# EAGLE design Main-v5.0 (EAGLE 9.1.0)
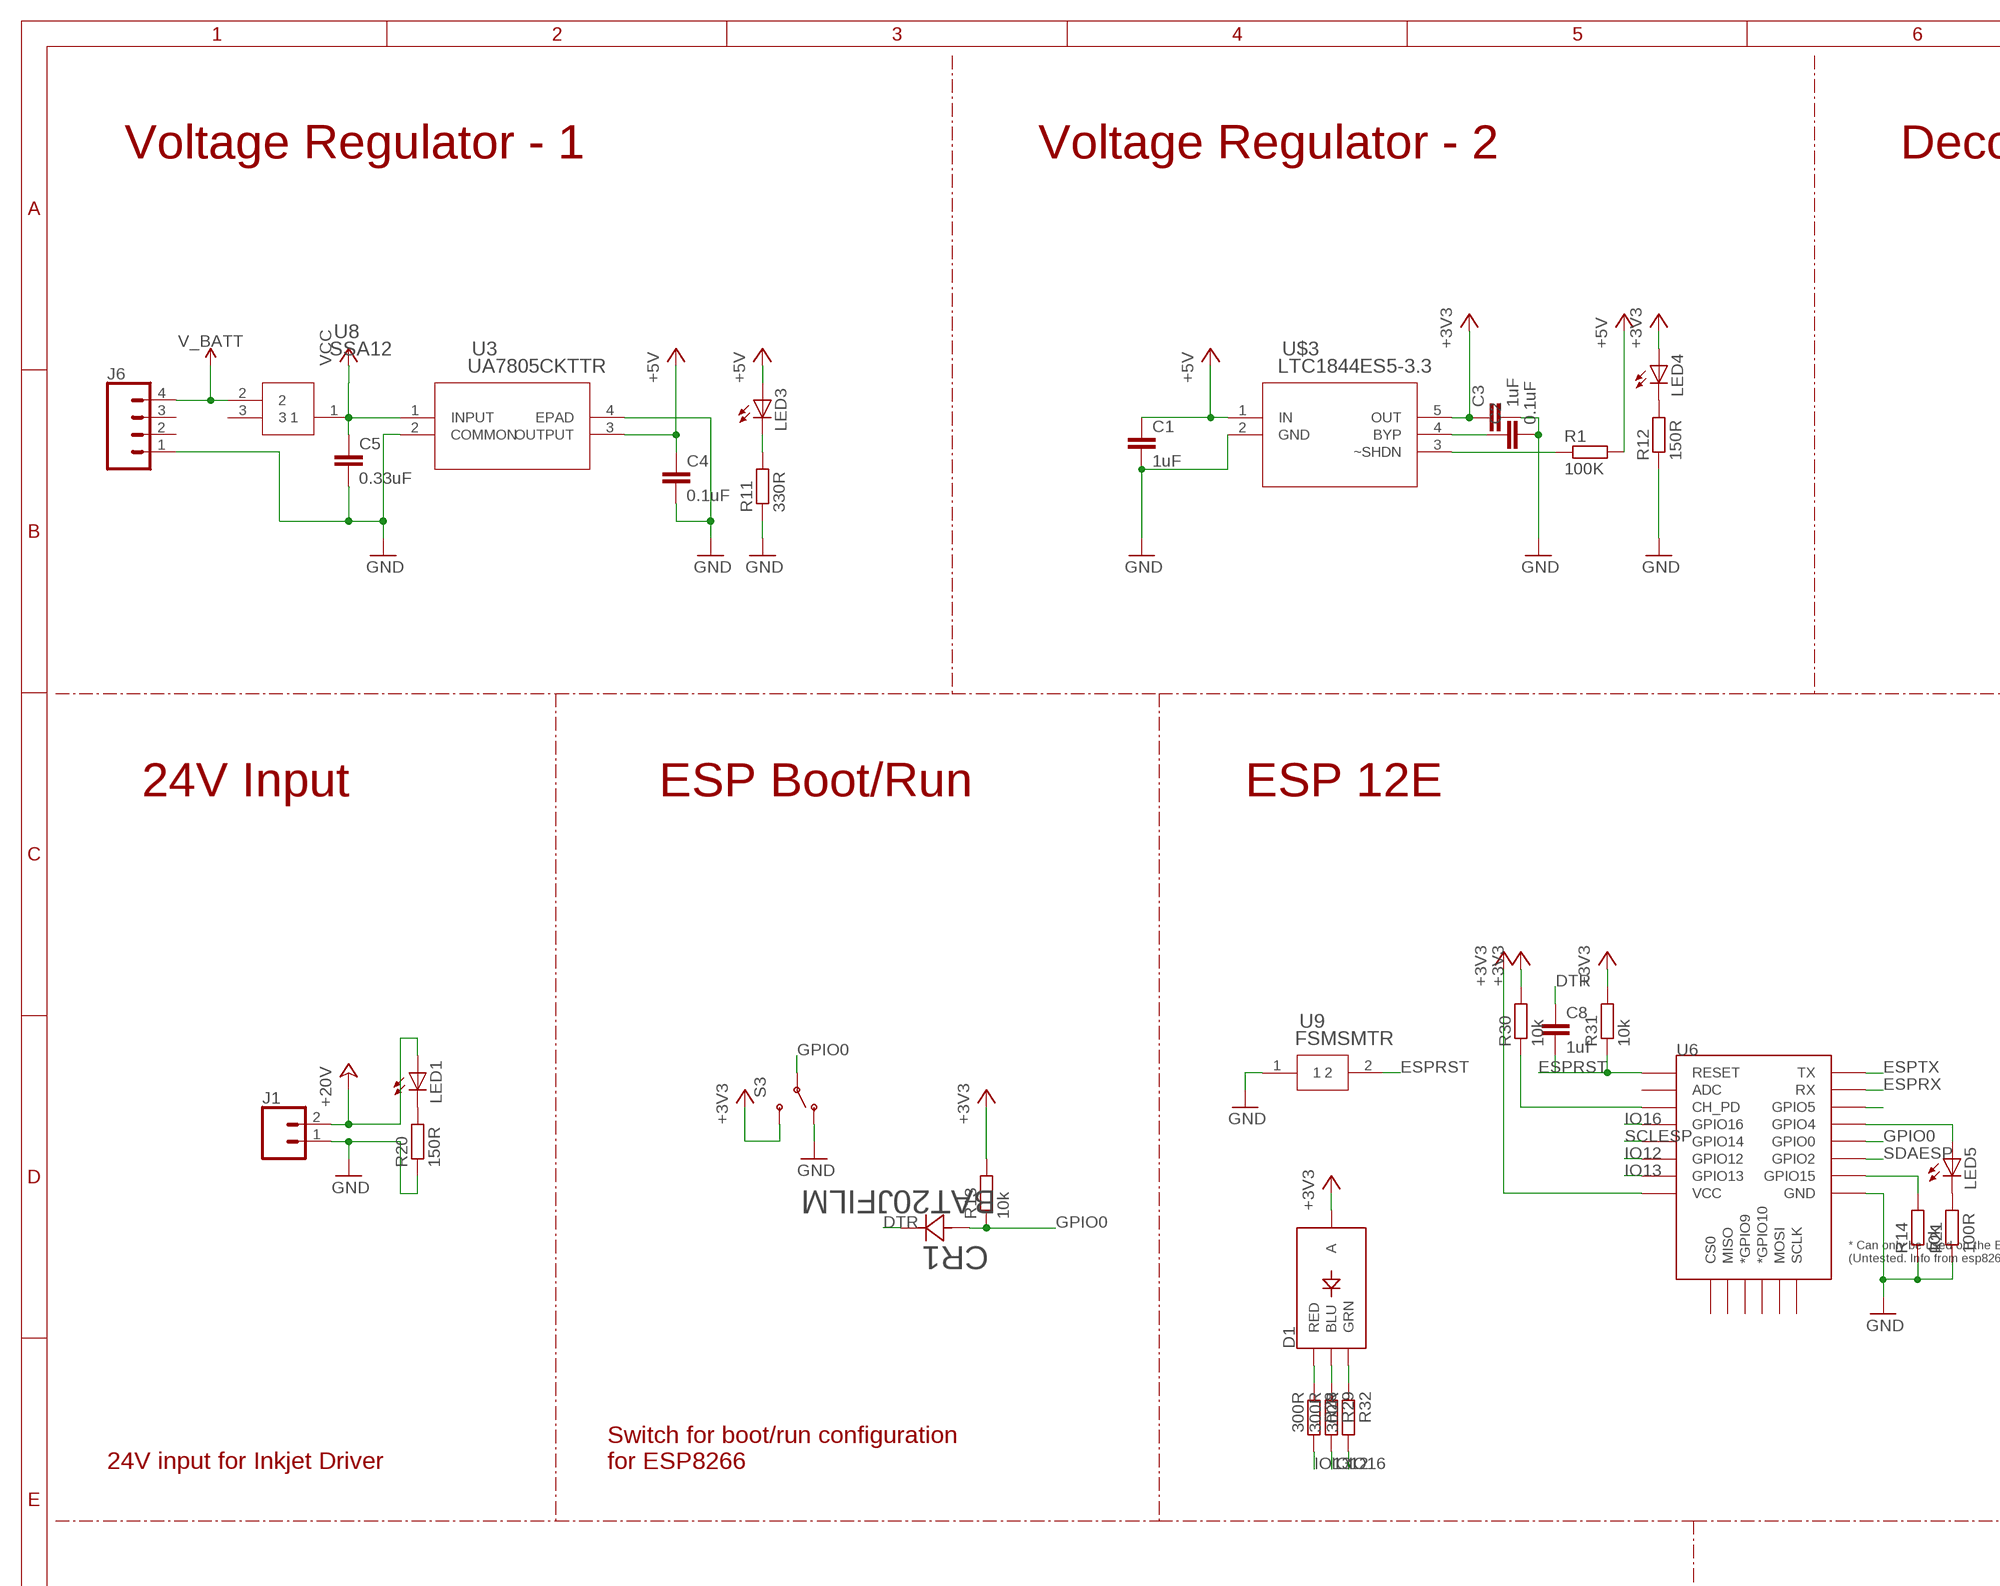
[diagram p0: schematic, sheet 1, part 1 of 3]
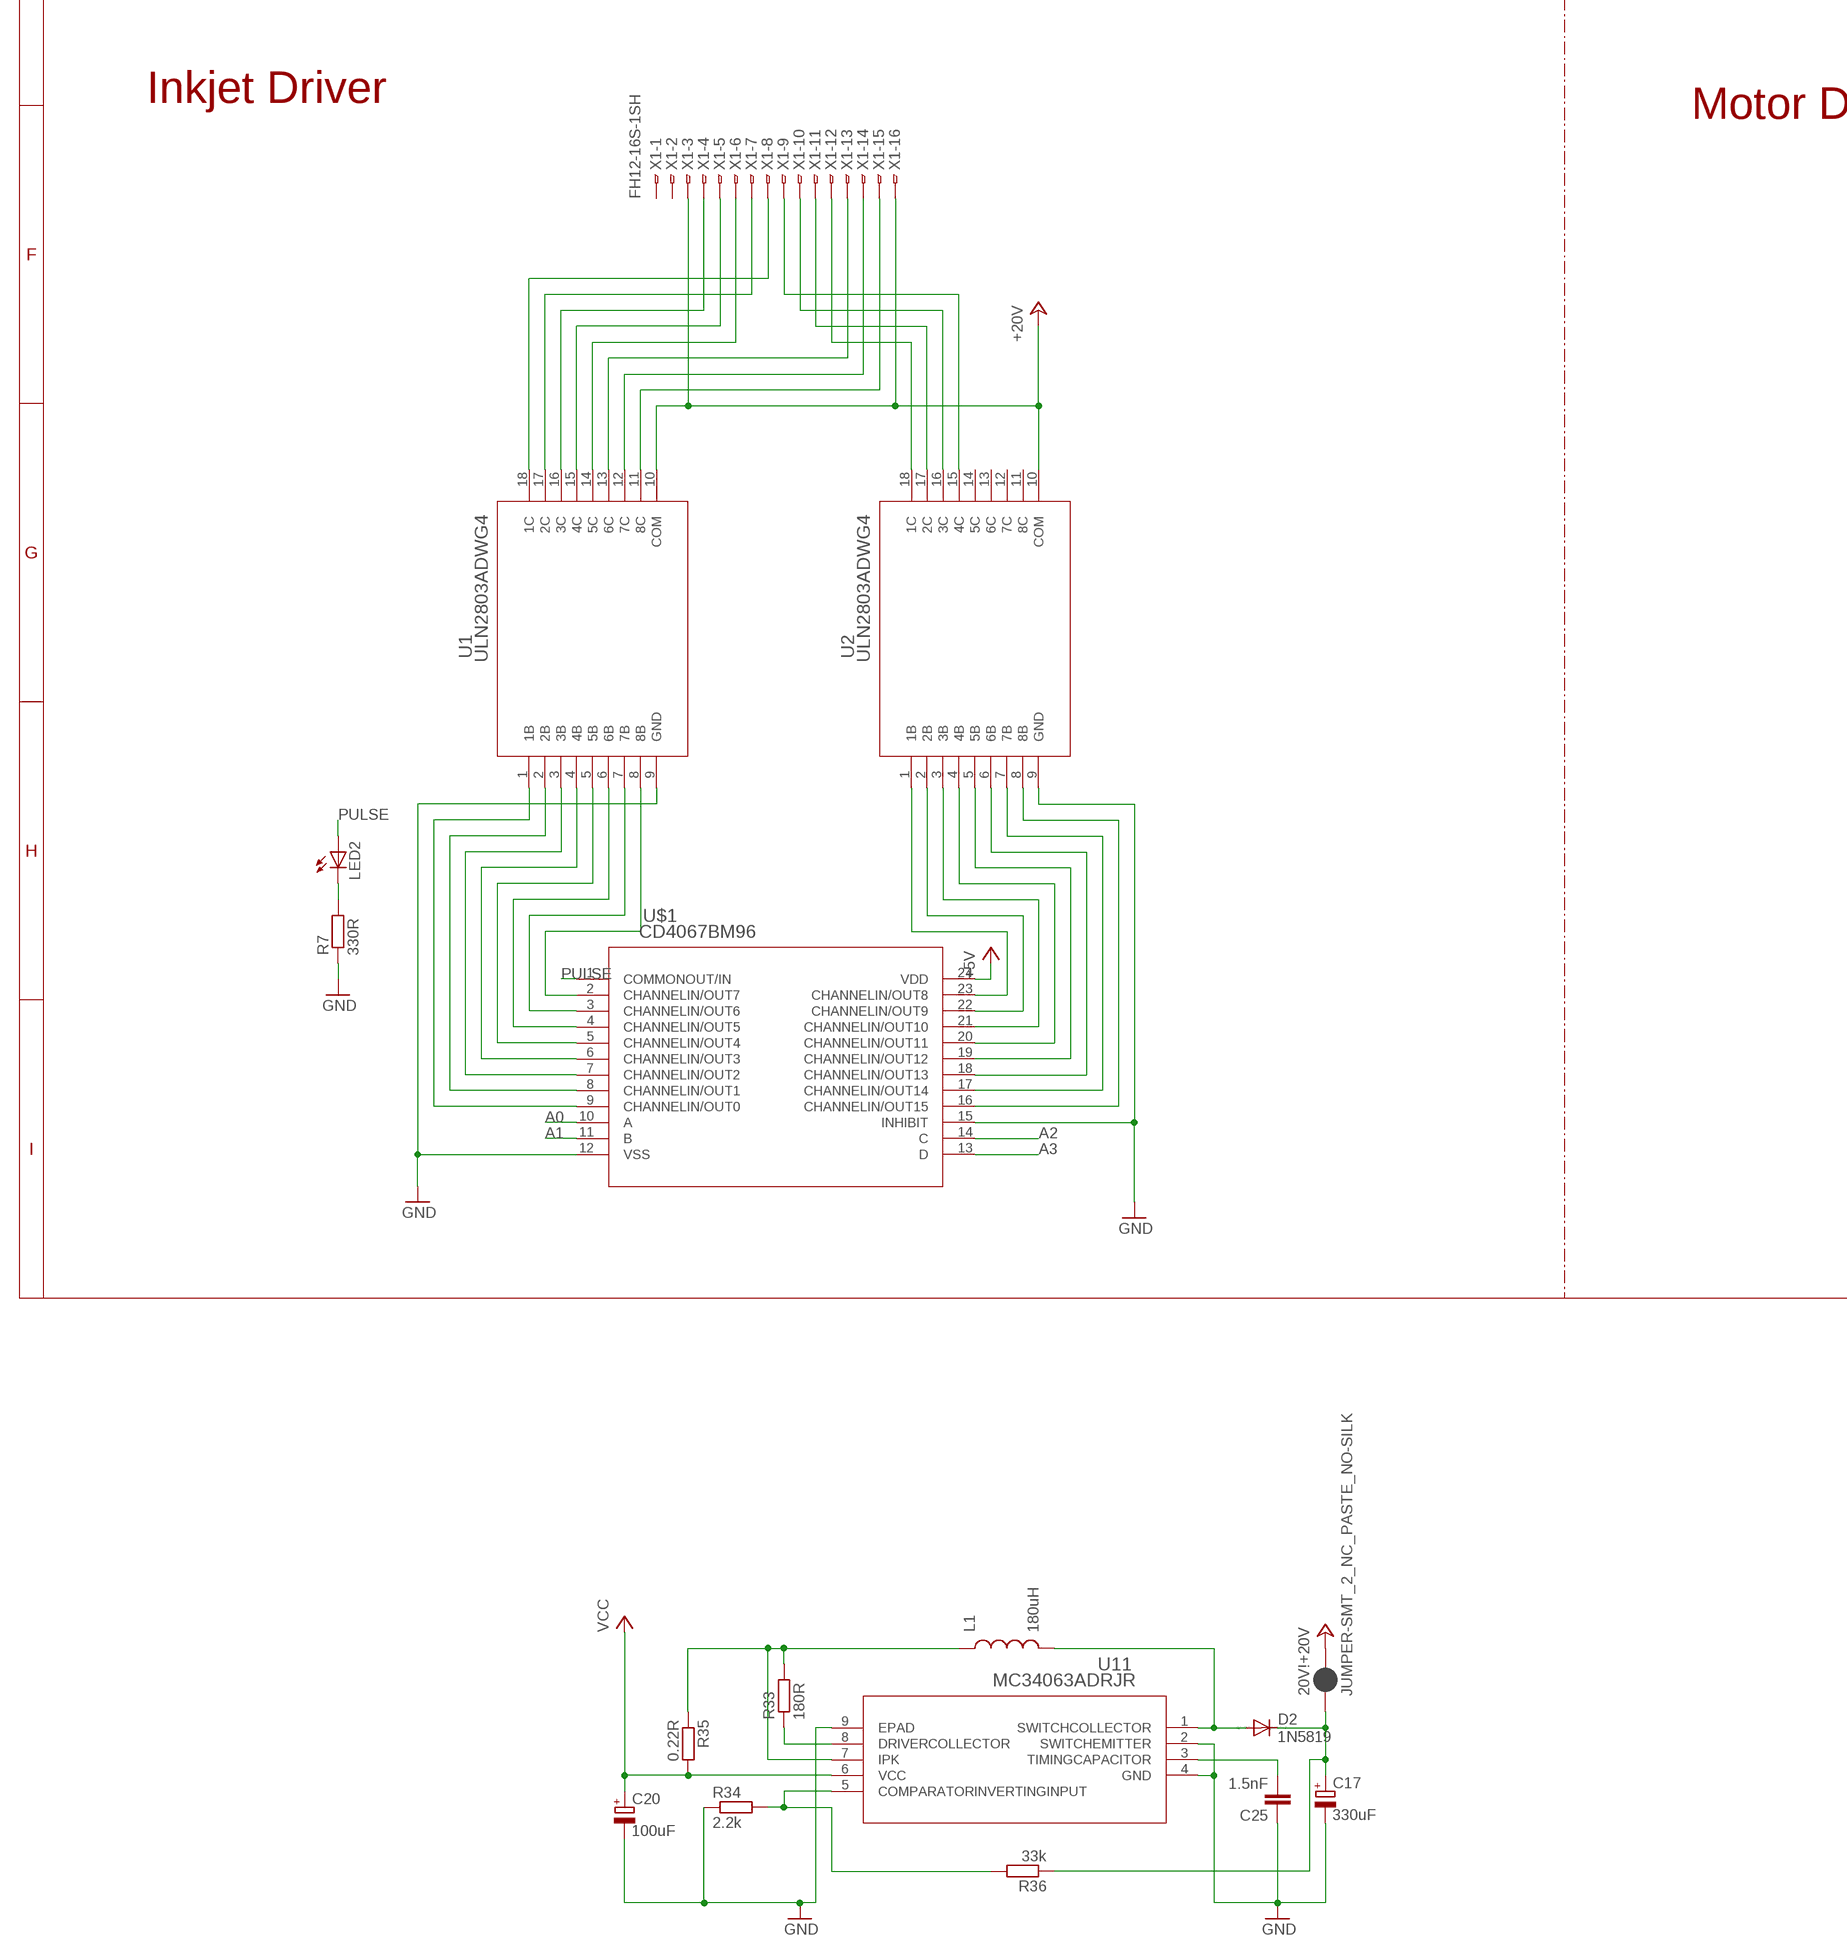
[diagram p1: schematic, sheet 1, part 2 of 3]
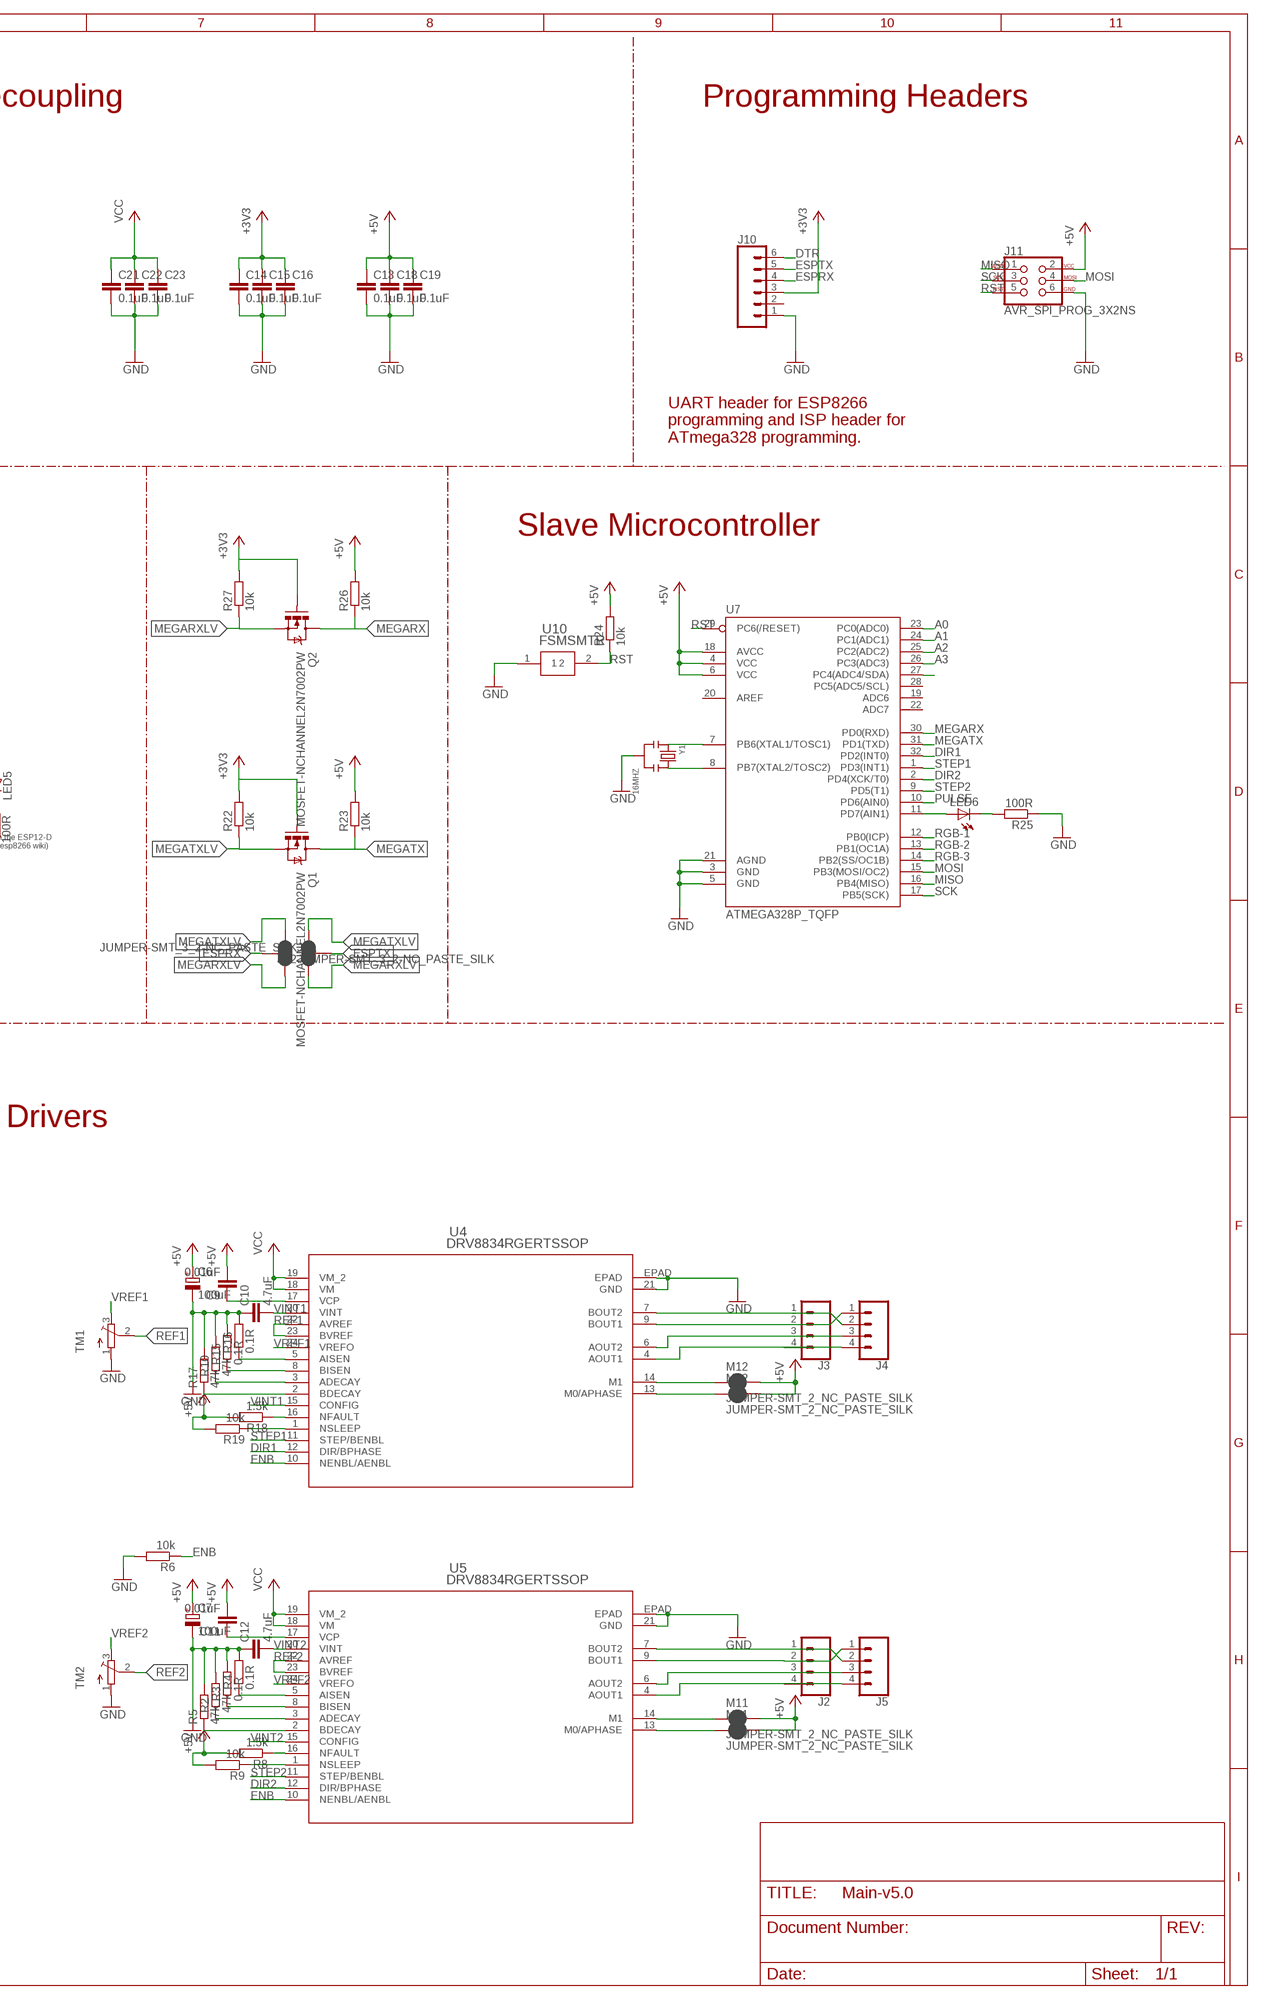
[diagram p2: schematic, sheet 1, part 3 of 3]

## Parts
20V!  JUMPER-SMT_2_NC_PASTE_NO-SILK  [SMT-JUMPER_2_NC_PASTE_NO-SILK]
C1  1uF  C-EUC0603  [C0603]
C2  0.1uF  C-EUC0603  [C0603]
C3  1uF  C-EUC0603  [C0603]
C4  0.1uF  C-EUC0603  [C0603]
C5  0.33uF  C-EUC0603  [C0603]
C6  100uF  CPOL-EUE5-5  [E5-5]
C7  100uF  CPOL-EUE5-5  [E5-5]
C8  1uf  C-EUC0603  [C0603]
C9  0.01uF  C-EUC0603K  [C0603K]
C10  4.7uF  C-EUC0603K  [C0603K]
C11  0.01uF  C-EUC0603K  [C0603K]
C12  4.7uF  C-EUC0603K  [C0603K]
C13  0.1uF  C-EUC0603  [C0603]
C14  0.1uF  C-EUC0603  [C0603]
C15  0.1uF  C-EUC0603  [C0603]
C16  0.1uF  C-EUC0603  [C0603]
C17  330uF  CPOL-EU153CLV-1010  [153CLV-1010]
C18  0.1uF  C-EUC0603  [C0603]
C19  0.1uF  C-EUC0603  [C0603]
C20  100uF  CPOL-EUSMCC  [SMC_C]
C21  0.1uF  C-EUC0603  [C0603]
C22  0.1uF  C-EUC0603  [C0603]
C23  0.1uF  C-EUC0603  [C0603]
C25  1.5nF  C-EUC0603K  [C0603K]
CR1  BAT20JFILM  [SOD-323]
D1  LED-RGB-CASMD  [LED-TRICOLOR-SMD]
D2  1N5819  [SOD123]
J1  CONN_02  [1X02]
J2  CONN_04  [1X04]
J3  CONN_04  [1X04]
J4  CONN_04  [1X04]
J5  CONN_04  [1X04]
J6  CONN_04  [1X04]
J10  CONN_06NO_SILK_NO_POP  [1X06_NO_SILK]
J11  AVR_SPI_PROG_3X2NS  [2X3-NS]
JP1  JUMPER-SMT_3_2-NC_PASTE_SILK  [SMT-JUMPER_3_2-NC_PASTE_SILK]
JP2  JUMPER-SMT_3_2-NC_PASTE_SILK  [SMT-JUMPER_3_2-NC_PASTE_SILK]
L1  180uH  INDUCTORCR54  [CR54]
LED1  LEDSML0603  [SML0603]
LED2  LEDSML0603  [SML0603]
LED3  LEDSML0603  [SML0603]
LED4  LEDSML0603  [SML0603]
LED5  LEDSML0603  [SML0603]
LED6  LEDSML0603  [SML0603]
M01  JUMPER-SMT_2_NC_PASTE_SILK  [SMT-JUMPER_2_NC_PASTE_SILK]
M02  JUMPER-SMT_2_NC_PASTE_SILK  [SMT-JUMPER_2_NC_PASTE_SILK]
M11  JUMPER-SMT_2_NC_PASTE_SILK  [SMT-JUMPER_2_NC_PASTE_SILK]
M12  JUMPER-SMT_2_NC_PASTE_SILK  [SMT-JUMPER_2_NC_PASTE_SILK]
Q1  MOSFET-NCHANNEL2N7002PW  [SOT323]
Q2  MOSFET-NCHANNEL2N7002PW  [SOT323]
R1  100K  R-EU_R0603  [R0603]
R2  47k  R-EU_R0402  [R0402]
R3  0.1R  R-EU_R0402  [R0402]
R4  0.1R  R-EU_R0402  [R0402]
R5  47k  R-EU_R0402  [R0402]
R6  10k  R-EU_R0402  [R0402]
R7  330R  R-EU_R0603  [R0603]
R8  1.5k  R-EU_R0402  [R0402]
R9  10k  R-EU_R0402  [R0402]
R10  47k  R-EU_R0402  [R0402]
R11  330R  R-EU_R0603  [R0603]
R12  150R  R-EU_R0603  [R0603]
R13  10k  R-EU_R0603  [R0603]
R14  10k  R-EU_R0603  [R0603]
R15  0.1R  R-EU_R0402  [R0402]
R16  0.1R  R-EU_R0402  [R0402]
R17  47k  R-EU_R0402  [R0402]
R18  1.5k  R-EU_R0402  [R0402]
R19  10k  R-EU_R0402  [R0402]
R20  150R  R-EU_R0603  [R0603]
R21  100R  R-EU_R0603  [R0603]
R22  10k  R-EU_R0603  [R0603]
R23  10k  R-EU_R0603  [R0603]
R24  10k  R-EU_R0603  [R0603]
R25  100R  R-EU_R0603  [R0603]
R26  10k  R-EU_R0603  [R0603]
R27  10k  R-EU_R0603  [R0603]
R28  300R  R-EU_R0603  [R0603]
R29  300R  R-EU_R0603  [R0603]
R30  10k  R-EU_R0603  [R0603]
R31  10k  R-EU_R0603  [R0603]
R32  300R  R-EU_R0603  [R0603]
R33  180R  R-EU_R0603  [R0603]
R34  2.2k  R-EU_R0603  [R0603]
R35  0.22R  R-EU_R0603  [R0603]
R36  33k  R-EU_R0603  [R0603]
S3  SWITCH-SPDT-SMD-A  [SWITCH-SPST-SMD-A]
TM1  TRIMPOTTC33X  [TC33X]
TM2  TRIMPOTTC33X  [TC33X]
U1  ULN2803ADWG4  [DW18]
U2  ULN2803ADWG4  [DW18]
U3  UA7805CKTTR  [KTT3_6P22X6P6]
U4  DRV8834RGERTSSOP  [PWP_24]
U5  DRV8834RGERTSSOP  [PWP_24]
U6  ESP12ESMD  [ESP12E-SMD]
U7  ATMEGA328P_TQFP  [TQFP32-08]
U8  SSA12  [SWSIP3-P98]
U9  FSMSMTR  [SWITCH_FSMSMTR]
U10  FSMSMTR  [SWITCH_FSMSMTR]
U11  MC34063ADRJR  [DRJ8_2P2X3]
U$1  CD4067BM96  [DW24]
U$3  LTC1844ES5-3.3  [TSOT-23_S5]
X1  FH12-16S-1SH  [FH12-16S-1SH]
Y1  16MHZ  SMD-RESONATOR-16MHZ-15PF-0.5%-40R(3P-3.2X1.3MM)  [X3-SMD-3.6X1.3X0.8MM]

## Nets
+3V3: C3.1 C14.1 C15.1 C16.1 D1.A J10.3 LED4.A Q1.1(G) Q2.1(G) R13.2 R22.2 R27.2 R30.2 R31.2 S3.3(S) U6.VCC U$3.5(OUT)
+5V: C1.1 C4.1 C6.+ C7.+ C9.2 C11.2 C13.1 C18.1 C19.1 J11.2 LED3.A M01.2 M02.2 M11.2 M12.2 R1.2 R8.2 R9.2 R18.2 R19.2 R23.2 R24.2 R26.2 U3.3(OUTPUT) U7.4(VCC) U7.6(VCC) U7.18(AVCC) U$1.24(VDD) U$3.1(IN)
+24V: 20V!.2 J1.2 LED1.A U1.10(COM) U2.10(COM) X1.3 X1.16 ; supply symbol labelled +20V
A0: U7.23(PC0(ADC0)) U$1.10(A)
A1: U7.24(PC1(ADC1)) U$1.11(B)
A2: U7.25(PC2(ADC2)) U$1.14(C)
A3: U7.26(PC3(ADC3)) U$1.13(D)
DIR1: U4.12(DIR/BPHASE) U7.32(PD2(INT0))
DIR2: U5.12(DIR/BPHASE) U7.2(PD4(XCK/T0))
DTR: C8.1 CR1.1 J10.6
ENB: R6.1 U4.10(NENBL/AENBL) U5.10(NENBL/AENBL)
ESPRST: C8.2 R31.1 U6.RESET U9.2
ESPRX: J10.4 JP1.2 U6.RXD0(RX)
ESPTX: J10.5 JP2.2 U6.TXD0(TX)
GND: C1.2 C2.2 C3.2 C4.2 C5.2 C6.- C7.- C10.1 C12.1 C13.2 C14.2 C15.2 C16.2 C17.- C18.2 C19.2 C20.- C21.2 C22.2 C23.2 C25.1 J1.1 J6.1 J10.1 J11.6 R2.2 R3.2 R4.2 R5.2 R6.2 R7.1 R10.2 R11.1 R12.1 R14.1 R15.2 R16.2 R17.2 R20.1 R21.1 R25.1 R34.1 S3.1(O) TM1.1(A) TM2.1(A) U1.9(GND) U2.9(GND) U3.2(COMMON) U3.4(EPAD) U4.21(GND) U4.EPAD U5.21(GND) U5.EPAD U6.GND U7.3(GND) U7.5(GND) U7.21(AGND) U9.1 U10.1 U11.2(SWITCHEMITTER) U11.4(GND) U11.9(EPAD) U$1.12(VSS) U$1.15(INHIBIT) U$3.2(GND) Y1.2
GPIO0: CR1.2 R13.1 S3.2(P) U6.GPIO0
IO12: R29.2 U6.GPIO12
IO13: R28.2 U6.GPIO13
IO16: R32.2 U6.GPIO16
MEGARX: Q2.3(D) R26.1 U7.30(PD0(RXD))
MEGARXLV: JP1.3 JP2.1 Q2.2(S) R27.1
MEGATX: Q1.3(D) R23.1 U7.31(PD1(TXD))
MEGATXLV: JP1.1 JP2.3 Q1.2(S) R22.1
MISO: J11.1 U7.16(PB4(MISO))
MOSI: J11.4 U7.15(PB3(MOSI/OC2))
N$3: U1.8(8B) U$1.2(CHANNELIN/OUT7)
N$4: U1.7(7B) U$1.3(CHANNELIN/OUT6)
N$5: U1.6(6B) U$1.4(CHANNELIN/OUT5)
N$6: U1.5(5B) U$1.5(CHANNELIN/OUT4)
N$7: U1.4(4B) U$1.6(CHANNELIN/OUT3)
N$8: U1.3(3B) U$1.7(CHANNELIN/OUT2)
N$9: U1.2(2B) U$1.8(CHANNELIN/OUT1)
N$10: U1.1(1B) U$1.9(CHANNELIN/OUT0)
N$11: U2.1(1B) U$1.23(CHANNELIN/OUT8)
N$12: U2.2(2B) U$1.22(CHANNELIN/OUT9)
N$13: U2.3(3B) U$1.21(CHANNELIN/OUT10)
N$14: U2.4(4B) U$1.20(CHANNELIN/OUT11)
N$15: U2.5(5B) U$1.19(CHANNELIN/OUT12)
N$16: U2.6(6B) U$1.18(CHANNELIN/OUT13)
N$17: J3.1 J4.2 U4.7(BOUT2)
N$18: J3.2 J4.1 U4.9(BOUT1)
N$19: J3.3 J4.3 U4.6(AOUT2)
N$20: J3.4 J4.4 U4.4(AOUT1)
N$21: U1.11(8C) X1.15
N$22: U1.12(7C) X1.14
N$23: U1.13(6C) X1.13
N$24: U1.14(5C) X1.6
N$25: U1.15(4C) X1.5
N$26: U1.16(3C) X1.4
N$27: U1.17(2C) X1.7
N$28: U1.18(1C) X1.8
N$29: U2.8(8B) U$1.16(CHANNELIN/OUT15)
N$30: U2.18(1C) X1.12
N$31: U2.17(2C) X1.11
N$32: U2.16(3C) X1.10
N$33: U2.15(4C) X1.9
N$34: U2.7(7B) U$1.17(CHANNELIN/OUT14)
N$35: J2.1 J5.2 U5.7(BOUT2)
N$36: J2.2 J5.1 U5.9(BOUT1)
N$37: L1.P$1 R33.2 R35.1 U11.7(IPK)
N$38: C2.1 U$3.4(BYP)
N$39: R1.1 U$3.3(~SHDN)
N$40: J2.3 J5.3 U5.6(AOUT2)
N$41: J2.4 J5.4 U5.4(AOUT1)
N$42: C11.1 U5.17(VCP)
N$43: R5.1 U5.2(BDECAY)
N$44: R2.1 U5.3(ADECAY)
N$45: LED2.C R7.2
N$46: R3.1 U5.8(BISEN)
N$47: R4.1 U5.5(AISEN)
N$48: R9.1 U5.1(NSLEEP)
N$49: R8.1 U5.16(NFAULT)
N$50: LED3.C R11.2
N$51: LED4.C R12.2
N$52: R30.1 U6.CH_PD
N$54: R17.1 U4.2(BDECAY)
N$55: LED6.C R25.2
N$56: LED5.C R21.2
N$57: LED6.A U7.11(PD7(AIN1))
N$58: U7.8(PB7(XTAL2/TOSC2)) Y1.3
N$59: U7.7(PB6(XTAL1/TOSC1)) Y1.1
N$60: D1.R(RED) R28.1
N$61: D1.B(BLU) R29.1
N$62: D1.G(GRN) R32.1
N$65: R10.1 U4.3(ADECAY)
N$66: R15.1 U4.8(BISEN)
N$67: R16.1 U4.5(AISEN)
N$68: C9.1 U4.17(VCP)
N$71: 20V!.1 C17.+ D2.C R36.1
N$72: R34.2 R36.2 U11.5(COMPARATORINVERTINGINPUT)
N$73: R19.1 U4.1(NSLEEP)
N$74: R18.1 U4.16(NFAULT)
N$75: M01.1 U5.13(M0/APHASE)
N$76: M11.1 U5.14(M1)
N$77: M02.1 U4.13(M0/APHASE)
N$78: M12.1 U4.14(M1)
N$79: LED1.C R20.2
N$80: LED5.A U6.GPIO4
N$84: R14.2 U6.GPIO15
N$85: R33.1 U11.8(DRIVERCOLLECTOR)
N$86: D2.A L1.P$2 U11.1(SWITCHCOLLECTOR)
N$88: C25.2 U11.3(TIMINGCAPACITOR)
N$91: U6.GPIO5
PULSE: LED2.A U7.10(PD6(AIN0)) U$1.1(COMMONOUT/IN)
REF1: TM1.2(S) U4.22(AVREF) U4.23(BVREF)
REF2: TM2.2(S) U5.22(AVREF) U5.23(BVREF)
RGB-1: U7.12(PB0(ICP))
RGB-2: U7.13(PB1(OC1A))
RGB-3: U7.14(PB2(SS/OC1B))
RST: J11.5 R24.1 U7.29(PC6(/RESET)) U10.2
SCK: J11.3 U7.17(PB5(SCK))
SCLESP: U6.GPIO14
SDA: U7.27(PC4(ADC4/SDA))
SDAESP: U6.GPIO2
STEP1: U4.11(STEP/BENBL) U7.1(PD3(INT1))
STEP2: U5.11(STEP/BENBL) U7.9(PD5(T1))
V_BATT: J6.4 U8.2
VCC: C5.1 C20.+ C21.1 C22.1 C23.1 R35.2 U3.1(INPUT) U4.18(VM) U4.19(VM_2) U5.18(VM) U5.19(VM_2) U8.1 U11.6(VCC)
VINT1: C10.2 U4.15(CONFIG) U4.20(VINT)
VINT2: C12.2 U5.15(CONFIG) U5.20(VINT)
VREF1: TM1.3(E) U4.24(VREFO)
VREF2: TM2.3(E) U5.24(VREFO)
Unconnected: J6.2 J6.3 J10.2 U2.11(8C) U2.12(7C) U2.13(6C) U2.14(5C) U6.ADC U6.CS0 U6.GPIO9(*GPIO9) U6.GPIO10(*GPIO10) U6.MISO U6.MOSI U6.SCLK U7.19(ADC6) U7.20(AREF) U7.22(ADC7) U7.28(PC5(ADC5/SCL)) U8.3 X1.1 X1.2

## Notes on the sheet
- Voltage Regulator - 1 | Voltage Regulator - 2 | Decoupling | Programming Headers
- UART header for ESP8266
  programming and ISP header for
  ATmega328 programming.
- 24V Input | ESP Boot/Run | ESP 12E | Slave Microcontroller
- 24V input for Inkjet Driver
- Switch for boot/run configuration
  for ESP8266
- Inkjet Driver
- Motor Drivers

## Library data of the parts
20V! M01 M02 M11 M12 = SparkFun-Jumpers:JUMPER-SMT_2_NC_PASTE: Normally closed solder jumper This jumper has an aperture in the stencil to allow solder paste to bridge the split in the wire so it's normally closed (NC). Wick off the solder to open the connection. Reapply solder to reclose the connection.
C1-C5 C8-C16 C18 C19 C21-C23 C25 = resistor:C-EU: CAPACITOR, European symbol
C6 C7 C17 C20 = resistor:CPOL-EU: POLARIZED CAPACITOR, European symbol
CR1 = Beeclust:BAT20JFILM; MANUFACTURER_PART_NUMBER: BAT20JFILM; VENDOR: ST Microelectronics
D1 = SparkFun-LED:LED-RGB-CA: LED-RGB Diffused Common Anode Packages: LED RGB-THRU P-LCC-4-3 LED-TRICOLOR-SMD SparkFun Products: RGB Diffused Common Anode- Diffuse <[https://www.sparkfun.com/products/10821]> RGB Diffused Common Anode - Clear <[https://www.sparkfun.com/products/10820]> Qduino Mini <[https://www.sparkfun.com/products/13614]> Triple Output LED RGB - SMD <https://www.sparkfun.com/products/7844>; PROD_ID: DIO-08324
D2 = Beeclust:1N5819: SCHOTTKY BARRIER RECTIFIER Source: http://onsemi.com .. MBR0520LT1-D.pdf
J1 = SparkFun-Connectors:CONN_02: Multi connection point. Often used as Generic Header-pin footprint for 0.1 inch spaced/style header connections On any of the 0.1 inch spaced packages, you can populate with these: Break Away Headers - Straight <https://www.sparkfun.com/products/116> (PRT-00116) Break Away Male Headers - Right Angle <https://www.sparkfun.com/products/553> (PRT-00553) Female Headers <https://www.sparkfun.com/products/115> (PRT-00115) Break Away Headers - Machine Pin <https://www.sparkfun.com/products/117> (PRT-00117) Break Away Female Headers - Swiss Machine Pin <https://www.sparkfun.com/products/743> (PRT-00743) For SCREWTERMINALS and SPRING TERMINALS visit here: Screw Terimnals on SparkFun.com <https://www.sparkfun.com/search/results?term=Screw+Terminals> (5mm/3.5mm/2.54mm spacing) This device is also useful as a general connection point to wire up your design to another part of your project. Our various solder wires solder well into these plated through hole pads. Hook-Up Wire - Assortment (Stranded, 22 AWG) <https://www.sparkfun.com/products/11375> (PRT-11375) Hook-Up Wire - Assortment (Solid Core, 22 AWG) <https://www.sparkfun.com/products/11367> (PRT-11367) View the entire wire category on our website here <https://www.sparkfun.com/categories/141> Special notes: Molex polarized connector foot print use with: PRT-08233 with associated crimp pins and housings. 2.54_SCREWTERM for use with PRT-10571. 3.5mm Screw Terminal footprints for PRT-08084 5mm Screw Terminal footprints for use with PRT-08432
J2-J6 = SparkFun-Connectors:CONN_04: Multi connection point. Often used as Generic Header-pin footprint for 0.1 inch spaced/style header connections On any of the 0.1 inch spaced packages, you can populate with these: Break Away Headers - Straight <https://www.sparkfun.com/products/116> (PRT-00116) Break Away Male Headers - Right Angle <https://www.sparkfun.com/products/553> (PRT-00553) Female Headers <https://www.sparkfun.com/products/115> (PRT-00115) Break Away Headers - Machine Pin <https://www.sparkfun.com/products/117> (PRT-00117) Break Away Female Headers - Swiss Machine Pin <https://www.sparkfun.com/products/743> (PRT-00743) For SCREWTERMINALS and SPRING TERMINALS visit here: Screw Terimnals on SparkFun.com <https://www.sparkfun.com/search/results?term=Screw+Terminals> (5mm/3.5mm/2.54mm spacing) This device is also useful as a general connection point to wire up your design to another part of your project. Our various solder wires solder well into these plated through hole pads. Hook-Up Wire - Assortment (Stranded, 22 AWG) <https://www.sparkfun.com/products/11375> (PRT-11375) Hook-Up Wire - Assortment (Solid Core, 22 AWG) <https://www.sparkfun.com/products/11367> (PRT-11367) View the entire wire category on our website here <https://www.sparkfun.com/categories/141> Special notes: Molex polarized connector foot print use with SKU : PRT-08231 with associated crimp pins and housings. 1MM SMD Version SKU: PRT-10208; PROD_ID: CONN-09696
J10 = SparkFun-Connectors:CONN_06: Multi connection point. Often used as Generic Header-pin footprint for 0.1 inch spaced/style header connections On any of the 0.1 inch spaced packages, you can populate with these: Break Away Headers - Straight <https://www.sparkfun.com/products/116> (PRT-00116) Break Away Male Headers - Right Angle <https://www.sparkfun.com/products/553> (PRT-00553) Female Headers <https://www.sparkfun.com/products/115> (PRT-00115) Break Away Headers - Machine Pin <https://www.sparkfun.com/products/117> (PRT-00117) Break Away Female Headers - Swiss Machine Pin <https://www.sparkfun.com/products/743> (PRT-00743) Arduino Stackable Header - 6 Pin <https://www.sparkfun.com/products/9280> (PRT-09280) For SCREWTERMINALS and SPRING TERMINALS visit here: Screw Terimnals on SparkFun.com <https://www.sparkfun.com/search/results?term=Screw+Terminals> (5mm/3.5mm/2.54mm spacing) This device is also useful as a general connection point to wire up your design to another part of your project. Our various solder wires solder well into these plated through hole pads. Hook-Up Wire - Assortment (Stranded, 22 AWG) <https://www.sparkfun.com/products/11375> (PRT-11375) Hook-Up Wire - Assortment (Solid Core, 22 AWG) <https://www.sparkfun.com/products/11367> (PRT-11367) View the entire wire category on our website here <https://www.sparkfun.com/categories/141>
J11 = SparkFun-Connectors:AVR_SPI_PROG_3X2: AVR ISP 6 Pin This is the reduced ISP connector for AVR programming. Common on Arduino. This footprint will take up less PCB space and can be used with a 10-pin to 6-pin adapter such as SKU: BOB-08508 **Special note about "TEST_POINT" package. The stop mask is on the top side, so if you want your programming test points to be on the bottom of your board, make sure to place this package on the bottom side of the board. This also ensure that the orientation to program from the bottom side will be correct. SparkFun Products: SparkFun ISP Pogo Adapter <https://www.sparkfun.com/products/11591> - NS Tiny AVR Programmer <https://www.sparkfun.com/products/11801> -PTH
JP1 JP2 = SparkFun-Jumpers:JUMPER-SMT_3_2-NC_PASTE: Normally closed solder jumper (2 of 2 connections) This jumper has an aperture in the stencil to allow solder paste to bridge both connections. Both connections are normally closed (NC). Wick off the solder to open the connection(s). Reapply solder to reclose the connection(s).
L1 = adjacent-reality:INDUCTOR: Inductors Basic Inductor/Choke - 0603 and 1206. Footprints are not proven and vary greatly between part numbers. CC-BY-SA from SparkFun
LED1-LED6 = led:LED: LED OSRAM: - CHIPLED LG R971, LG N971, LY N971, LG Q971, LY Q971, LO R971, LY R971 LH N974, LH R974 LS Q976, LO Q976, LY Q976 LO Q996 - Hyper CHIPLED LW Q18S LB Q993, LB Q99A, LB R99A - SideLED LS A670, LO A670, LY A670, LG A670, LP A670 LB A673, LV A673, LT A673, LW A673 LH A674 LY A675 LS A676, LA A676, LO A676, LY A676, LW A676 LS A679, LY A679, LG A679 - Hyper Micro SIDELED® LS Y876, LA Y876, LO Y876, LY Y876 LT Y87S - SmartLED LW L88C, LW L88S LB L89C, LB L89S, LG L890 LS L89K, LO L89K, LY L89K LS L896, LA L896, LO L896, LY L896 - TOPLED LS T670, LO T670, LY T670, LG T670, LP T670 LSG T670, LSP T670, LSY T670, LOP T670, LYG T670 LG T671, LOG T671, LSG T671 LB T673, LV T673, LT T673, LW T673 LH T674 LS T676, LA T676, LO T676, LY T676, LB T676, LH T676, LSB T676, LW T676 LB T67C, LV T67C, LT T67C, LS T67K, LO T67K, LY T67K, LW E67C LS E67B, LA E67B, LO E67B, LY E67B, LB E67C, LV E67C, LT E67C LW T67C LS T679, LY T679, LG T679 LS T770, LO T770, LY T770, LG T770, LP T770 LB T773, LV T773, LT T773, LW T773 LH T774 LS E675, LA E675, LY E675, LS T675 LS T776, LA T776, LO T776, LY T776, LB T776 LHGB T686 LT T68C, LB T68C - Hyper Mini TOPLED® LB M676 - Mini TOPLED Santana® LG M470 LS M47K, LO M47K, LY M47K Source: http://www.osram.convergy.de LUXEON: - LUMILED® LXK2-PW12-R00, LXK2-PW12-S00, LXK2-PW14-U00, LXK2-PW14-V00 LXK2-PM12-R00, LXK2-PM12-S00, LXK2-PM14-U00 LXK2-PE12-Q00, LXK2-PE12-R00, LXK2-PE12-S00, LXK2-PE14-T00, LXK2-PE14-U00 LXK2-PB12-K00, LXK2-PB12-L00, LXK2-PB12-M00, LXK2-PB14-N00, LXK2-PB14-P00, LXK2-PB14-Q00 LXK2-PR12-L00, LXK2-PR12-M00, LXK2-PR14-Q00, LXK2-PR14-R00 LXK2-PD12-Q00, LXK2-PD12-R00, LXK2-PD12-S00 LXK2-PH12-R00, LXK2-PH12-S00 LXK2-PL12-P00, LXK2-PL12-Q00, LXK2-PL12-R00 Source: www.luxeon.com KINGBRIGHT: KA-3528ASYC Source: www.kingbright.com
Q1 Q2 = SparkFun-DiscreteSemi:MOSFET-NCHANNEL: Common NMOSFET Parts MFG P/N Store ID Prod ID FDD8780 TRANS-09984 SI7820DN TRANS-11055 FDS6630A IC-08089 2N7002PW TRANS-11151 FQP30N06L COM-10213 TRANS-10060 BSS123LT1G TRANS-08345 BSS138 TRANS-00830 BS170 2N7000; PROD_ID: TRANS-11151
R1-R36 = resistor:R-EU_: RESISTOR, European symbol
S3 = SparkFun-Electromechanical:SWITCH-SPDT: SPDT Switch Simple slide switch, Spark Fun Electronics SKU : COM-00102 DPDT SMT slide switch, AYZ0202, SWCH-08179; PROD_ID: SWCH-10651
TM1 TM2 = adafruit:TRIMPOT: SMT trimmer potentiometer part number TC33X http://www.ladyada.net/library/eagle
U1 U2 = Beeclust:ULN2803ADWG4; MANUFACTURER_PART_NUMBER: ULN2803ADWG4; VENDOR: Texas Instruments
U3 = Beeclust:UA7805CKTTR; MANUFACTURER_PART_NUMBER: UA7805CKTTR; VENDOR: Texas Instruments
U4 U5 = Beeclust:DRV8834RGER
U6 = esp8266modules:ESP12E: ESP12E Module
U7 = SparkFun-IC-Microcontroller:ATMEGA328P_TQFP: Popular 328P in QFP Storefront component: ATmega328 - TQFP <https://www.sparkfun.com/products/13448> (COM-13448) Datasheet <http://www.sparkfun.com/datasheets/Components/SMD/ATMega328.pdf> SparkFun Products SparkFun RedBoard - Programmed with Arduino <https://www.sparkfun.com/products/12757> (DEV-12757) Arduino Pro Mini 328 - 5V/16MHz <https://www.sparkfun.com/products/11113> (DEV-11113) Arduino Pro Mini 328 - 3.3V/8MHz <https://www.sparkfun.com/products/11114> (DEV-11114) SparkFun OpenLog <https://www.sparkfun.com/products/13712> (DEV-13712) SparkFun MicroView - OLED Arduino Module <https://www.sparkfun.com/products/12923> (DEV-12923) SparkFun Digital Sandbox <https://www.sparkfun.com/products/12651> (DEV-12651) SparkFun PicoBoard <https://www.sparkfun.com/products/11888> (WIG-11888) Arduino Fio <https://www.sparkfun.com/products/10116> (DEV-10116) LilyPad Arduino 328 Main Board <https://www.sparkfun.com/products/13342> (DEV-13342) SparkFun RedStick <https://www.sparkfun.com/products/13741> (DEV-13741) LilyPad MP3 <https://www.sparkfun.com/products/11013> (DEV-11013) LilyPad Arduino SimpleSnap <https://www.sparkfun.com/products/10941> (DEV-10941) SparkFun Stepoko <https://www.sparkfun.com/products/13899> (ROB-13899) SparkFun Geiger Counter <https://www.sparkfun.com/products/11345> (SEN-11345) SparkFun EL Sequencer <https://www.sparkfun.com/products/12781> (COM-12781) Arduino Pro 328 - 5V/16MHz <https://www.sparkfun.com/products/10915> (DEV-10915) CryptoCape <https://www.sparkfun.com/products/12773> (DEV-12773) SparkFun IR Thermometer Evaluation Board - MLX90614 <https://www.sparkfun.com/products/10740> (SEN-10740) SparkFun RedBot Mainboard <https://www.sparkfun.com/products/12097> (ROB-12097) Arduino Pro 328 - 3.3V/8MHz <https://www.sparkfun.com/products/10914> (DEV-10914) SparkFun Block for Intel® Edison - Arduino <https://www.sparkfun.com/products/13036> (DEV-13036) SparkFun Simon Says - Surface Mount Soldering Kit <https://www.sparkfun.com/products/10935> (KIT-10935) SparkFun 7-Segment Serial Display - Red <https://www.sparkfun.com/products/11441> (COM-11441) SparkFun 7-Segment Serial Display - White <https://www.sparkfun.com/products/11629> (COM-11629) SparkFun 7-Segment Serial Display - Yellow <https://www.sparkfun.com/products/11443> (COM-11443) SparkFun 7-Segment Serial Display - Kelly Green <https://www.sparkfun.com/products/11440> (COM-11440) SparkFun 7-Segment Serial Display - Blue <https://www.sparkfun.com/products/11442> (COM-11442) SparkFun OpenSegment Serial Display - 20mm (Blue) <https://www.sparkfun.com/products/11647> (COM-11647) SparkFun OpenSegment Serial Display - 20mm (Green) <https://www.sparkfun.com/products/11646> (COM-11646) SparkFun OpenSegment Serial Display - 20mm (White) <https://www.sparkfun.com/products/11648> (COM-11648) SparkFun OpenSegment Serial Display - 20mm (Red) <https://www.sparkfun.com/products/11644> (COM-11644) SparkFun OpenSegment Serial Display - 20mm (Yellow) <https://www.sparkfun.com/products/11645> (COM-11645) SparkFun OpenSegment Shield <https://www.sparkfun.com/products/13190> (DEV-13190); PROD_ID: IC-09069
U8 = Beeclust:SSA12; MANUFACTURER_PART_NUMBER: SSA12; VENDOR: TE Connectivity
U9 U10 = Beeclust:FSMSMTR; MANUFACTURER_PART_NUMBER: FSMSMTR; VENDOR: TE Connectivity
U11 = Beeclust:MC34063ADRJR; MANUFACTURER_PART_NUMBER: MC34063ADRJR; VENDOR: Vendor
U$1 = Beeclust:CD4067BM96; MANUFACTURER_PART_NUMBER: CD4067B_DW_24; VENDOR: Texas Instruments
U$3 = Beeclust:LTC1844ES5-3.3
X1 = con-hirose:FH12-16S-1S: 1mm Pitch Connectors For FPC/FFC Source: Data sheet <http://www.hirose.co.jp/cataloge_hp/e58605370.pdf>; OC_FARNELL: unknown; OC_NEWARK: unknown
Y1 = Seeed-Crystal Oscillator:SMD-RESONATOR-16MHZ-15PF-0.5%-40R(3P-3.2X1.3MM): 306030002; MPN: CSTCE16M0V53-R0

## Board
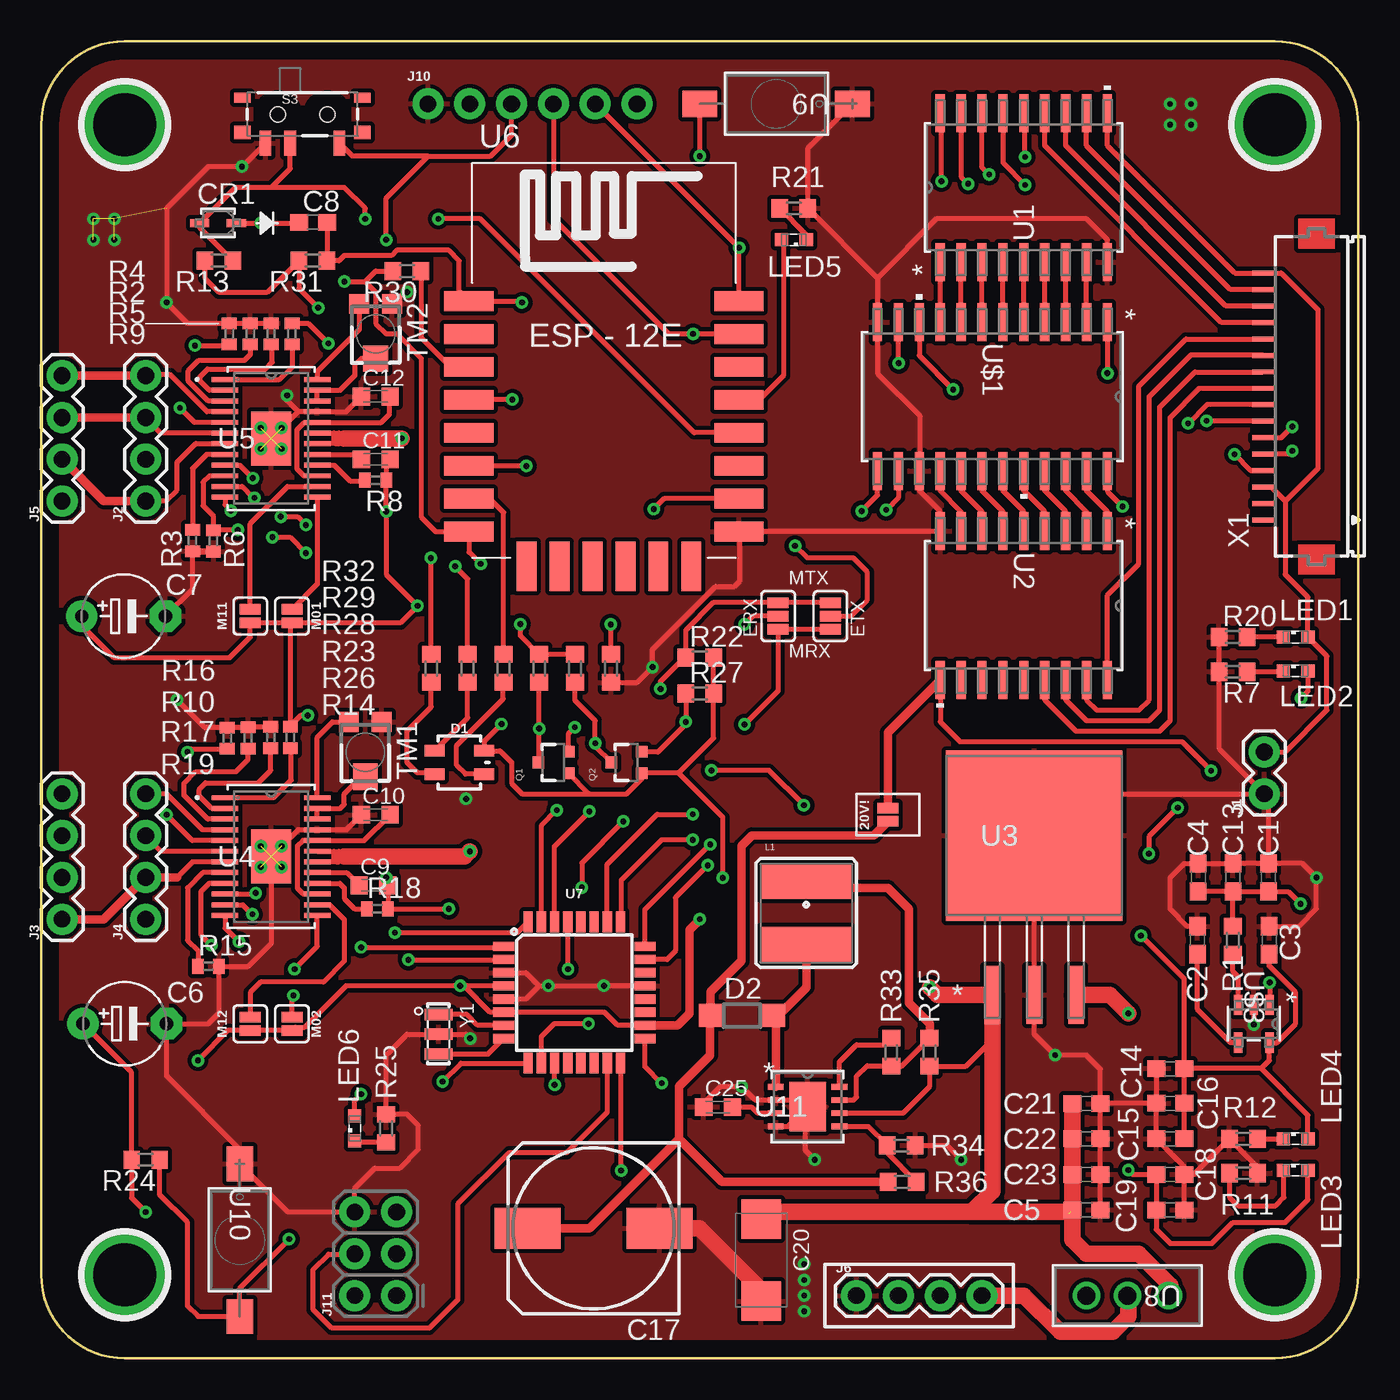
[diagram p3: board, top side]
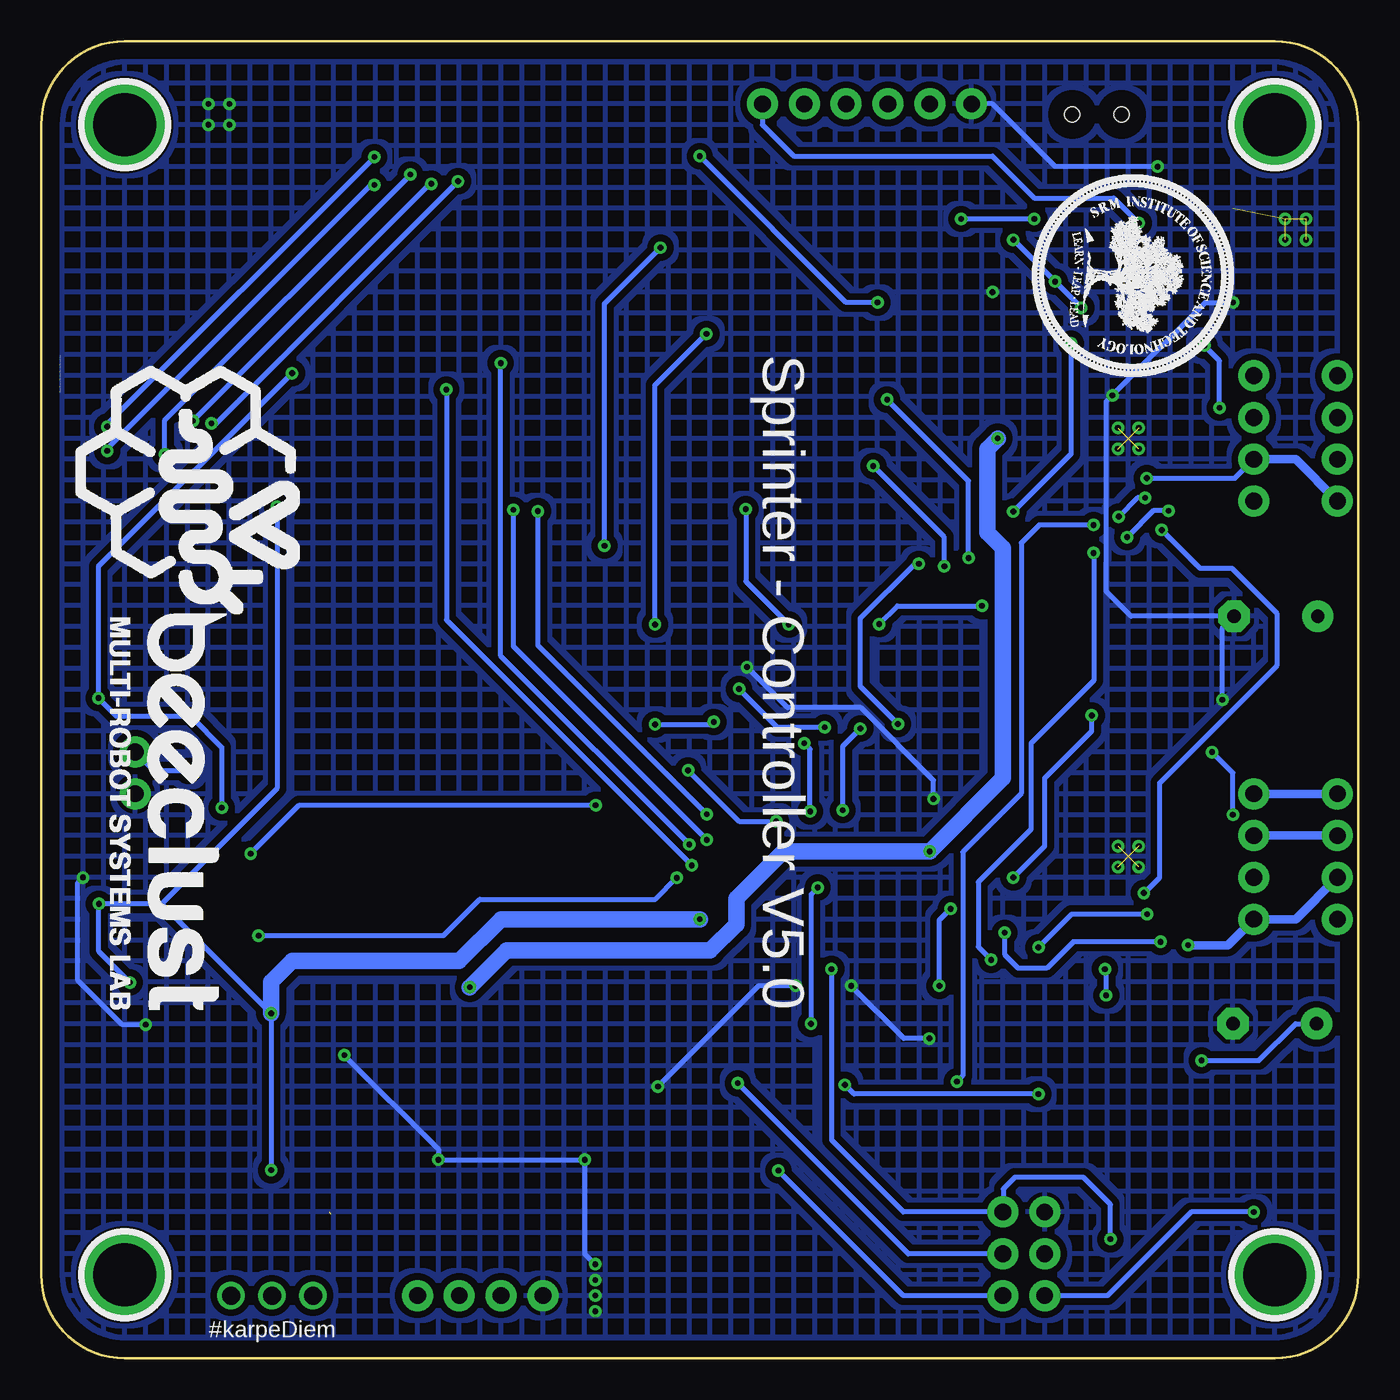
[diagram p4: board, bottom side, seen from below]

Size 80.01 x 80.01 mm. Coordinates in mm from the lower left corner, seen from the top.
Outline: 80.01,5.08 80.01,72.39
Outline: 80.01,5.08 80.01,74.93 arc90 74.93,80.01 5.08,80.01 arc90 0,74.93 0,5.08 arc90 5.08,0 74.93,0 arc90 80.01,5.08
Copper layers (1*16): Top 0.035mm / dielectric 1.5mm / Bottom 0.035mm
Design rules "default *": minimum track width 6mil, minimum drill 0.35mm, track to track 6mil, track to pad 6mil, pad to pad 6mil, via to via 6mil, smd to smd 6mil, copper to edge 40mil, drill to drill 6mil, minimum pad ring 10mil, minimum via ring 8mil, stop-mask expansion 4mil, vias tented up to drill 14mil, thermal gap 10mil

### Footprints (pad centres in the part's own frame; a part is rotated, then mirrored left to right if it is on the bottom)
SMT-JUMPER_2_NC_PASTE_NO-SILK = smd 0.635 x 1.27: 1 -0.406,0; 2 0.406,0
C0603 = smd 1.1 x 1: 1 -0.85,0; 2 0.85,0
E5-5 = drill 0.813 pad 1.905: + -2.54,0 | drill 0.813 pad 1.905 octagon: - 2.54,0
C0603K = smd 1.05 x 1.08: 1 -0.875,0; 2 0.875,0
153CLV-1010 = smd 4 x 2.5: + 4,0; - -4,0
SMC_C = smd 2.4 x 2.4: + -2.5,0; - 2.5,0
SOD-323 = smd 1.168 x 0.483: 1 -1.118,0; 2 1.118,0
LED-TRICOLOR-SMD = smd 1.2 x 0.7: A 1.5,0.7; B -1.5,0.7; G -1.5,-0.7; R 1.5,-0.7
SOD123 = smd 1.4 x 1.4: A 1.9,0; C -1.9,0
1X02 = drill 1.016 pad 1.88: 1 0,0; 2 2.54,0
1X04 = drill 1.016 pad 1.88: 1 0,0; 2 2.54,0; 3 5.08,0; 4 7.62,0
1X06_NO_SILK = drill 1.016 pad 1.88: 1 0,0; 2 2.54,0; 3 5.08,0; 4 7.62,0; 5 10.16,0; 6 12.7,0
2X3-NS = drill 1.016 pad 1.88: 1 -2.54,-1.27; 2 -2.54,1.27; 3 0,-1.27; 4 0,1.27; 5 2.54,-1.27; 6 2.54,1.27
SMT-JUMPER_3_2-NC_PASTE_SILK = smd 0.635 x 1.27: 1 -0.813,0; 2 0,0; 3 0.813,0
CR54 = smd 5.5 x 2.15: P$1 0,1.92; P$2 0,-1.92
SML0603 = smd 0.8 x 0.8: A 0.75,0; C -0.75,0
SMT-JUMPER_2_NC_PASTE_SILK = smd 0.635 x 1.27: 1 -0.406,0; 2 0.406,0
SOT323 = smd 0.7 x 0.7: 1 -0.65,-0.925; 2 0.65,-0.925; 3 0,0.925
R0603 = smd 1 x 1.1: 1 -0.85,0; 2 0.85,0
R0402 = smd 0.7 x 0.9: 1 -0.65,0; 2 0.65,0
SWITCH-SPST-SMD-A = smd 0.7 x 1.5: 1 -2.25,-1.75; 2 -0.75,-1.75; 3 2.25,-1.75 | smd 1 x 0.6: GND1 -3.65,1; GND3 3.65,1 | smd 1 x 0.8: GND2 -3.65,-1.1; GND4 3.65,-1.1 | hole 0.9: -1.5,0; 1.5,0
TC33X = smd 1.2 x 1.2: 1 -1,-1.825; 3 1,-1.825 | smd 1.5 x 1.6: 2 0,1.5
DW18 = smd 2.311 x 0.559: 1 -4.521,5.08; 2 -4.521,3.81; 3 -4.521,2.54; 4 -4.521,1.27; 5 -4.521,0; 6 -4.521,-1.27; 7 -4.521,-2.54; 8 -4.521,-3.81; 9 -4.521,-5.08; 10 4.521,-5.08; 11 4.521,-3.81; 12 4.521,-2.54; 13 4.521,-1.27; 14 4.521,0; 15 4.521,1.27; 16 4.521,2.54; 17 4.521,3.81; 18 4.521,5.08
KTT3_6P22X6P6 = smd 0.965 x 3.505: 1 -2.54,-9.677; 2 0,-9.677; 3 2.54,-9.677 | smd 10.719 x 10.363: 4 0,0
PWP_24 = smd 1.6 x 0.3: 1 -2.8,3.575; 2 -2.8,2.925; 3 -2.8,2.275; 4 -2.8,1.625; 5 -2.8,0.975; 6 -2.8,0.325; 7 -2.8,-0.325; 8 -2.8,-0.975; 9 -2.8,-1.625; 10 -2.8,-2.275; 11 -2.8,-2.925; 12 -2.8,-3.575; 13 2.8,-3.575; 14 2.8,-2.925; 15 2.8,-2.275; 16 2.8,-1.625; 17 2.8,-0.975; 18 2.8,-0.325; 19 2.8,0.325; 20 2.8,0.975; 21 2.8,1.625; 22 2.8,2.275; 23 2.8,2.925; 24 2.8,3.575 | smd 2.4 x 3.28: EPAD 0,0
ESP12E-SMD = smd 3 x 1.2: ADC -8.3,3.8; CH_PD -8.3,1.8; GND 8.1,-8.2; GPIO0 8.1,-2.2; GPIO2 8.1,-4.2; GPIO4 8.1,-0.2; GPIO5 8.1,1.8; GPIO12 -8.3,-4.2; GPIO13 -8.3,-6.2; GPIO14 -8.3,-2.2; GPIO15 8.1,-6.2; GPIO16 -8.3,-0.2; RESET -8.3,5.8; RXD0 8.1,3.8; TXD0 8.1,5.8; VCC -8.3,-8.2 | smd 1.2 x 3: CS0 -4.8,-10.3; GPIO9 -0.8,-10.3; GPIO10 1.2,-10.3; MISO -2.8,-10.3; MOSI 3.2,-10.3; SCLK 5.2,-10.3
TQFP32-08 = smd 1.27 x 0.559: 1 -4.293,2.8; 2 -4.293,2; 3 -4.293,1.2; 4 -4.293,0.4; 5 -4.293,-0.4; 6 -4.293,-1.2; 7 -4.293,-2; 8 -4.293,-2.8; 17 4.293,-2.8; 18 4.293,-2; 19 4.293,-1.2; 20 4.293,-0.4; 21 4.293,0.4; 22 4.293,1.2; 23 4.293,2; 24 4.293,2.8 | smd 0.559 x 1.27: 9 -2.8,-4.293; 10 -2,-4.293; 11 -1.2,-4.293; 12 -0.4,-4.293; 13 0.4,-4.293; 14 1.2,-4.293; 15 2,-4.293; 16 2.8,-4.293; 25 2.8,4.293; 26 2,4.293; 27 1.2,4.293; 28 0.4,4.293; 29 -0.4,4.293; 30 -1.2,4.293; 31 -2,4.293; 32 -2.8,4.293
SWSIP3-P98 = drill 1.092 pad 1.651: 1 -4.978,0; 2 -2.489,0; 3 0,0
SWITCH_FSMSMTR = smd 2.108 x 1.6: 1 -9.271,0; 2 0,0
DRJ8_2P2X3 = smd 0.95 x 0.35: 1 -1.93,1.2; 2 -1.93,0.4; 3 -1.93,-0.4; 4 -1.93,-1.2; 5 1.93,-1.2; 6 1.93,-0.4; 7 1.93,0.4; 8 1.93,1.2 | smd 2.2 x 3: 9 0,0
DW24 = smd 2.311 x 0.559: 1 -4.521,6.985; 2 -4.521,5.715; 3 -4.521,4.445; 4 -4.521,3.175; 5 -4.521,1.905; 6 -4.521,0.635; 7 -4.521,-0.635; 8 -4.521,-1.905; 9 -4.521,-3.175; 10 -4.521,-4.445; 11 -4.521,-5.715; 12 -4.521,-6.985; 13 4.521,-6.985; 14 4.521,-5.715; 15 4.521,-4.445; 16 4.521,-3.175; 17 4.521,-1.905; 18 4.521,-0.635; 19 4.521,0.635; 20 4.521,1.905; 21 4.521,3.175; 22 4.521,4.445; 23 4.521,5.715; 24 4.521,6.985
TSOT-23_S5 = smd 1.219 x 0.508: 1 -1.143,0.95; 2 -1.143,0; 3 -1.143,-0.95; 4 1.143,-0.95; 5 1.143,0.95
FH12-16S-1SH = smd 0.3 x 1.3: 1 -7.5,3.25; 2 -6.5,3.25; 3 -5.5,3.25; 4 -4.5,3.25; 5 -3.5,3.25; 6 -2.5,3.25; 7 -1.5,3.25; 8 -0.5,3.25; 9 0.5,3.25; 10 1.5,3.25; 11 2.5,3.25; 12 3.5,3.25; 13 4.5,3.25; 14 5.5,3.25; 15 6.5,3.25; 16 7.5,3.25
X3-SMD-3.6X1.3X0.8MM = smd 0.7 x 1.7: 1 -1.2,0; 2 0,0; 3 1.2,0

### Placement (x,y rotation side)
20V!  51.44,33.02 90 top
C1  74.55,29.21 90 top
C2  70.23,25.4 90 top
C3  74.6,25.4 90 top
C4  70.28,29.21 90 top
C5  63.5,9.02 0 top
C6  5.08,20.32 0 top
C7  5,45.09 0 top
C8  16.51,69.01 0 top
C9  20.19,28.73 0 top
C10  20.32,33.02 0 top
C11  20.32,54.61 0 top
C12  20.32,58.42 0 top
C13  72.39,29.21 90 top
C14  68.58,17.6 180 top
C15  68.58,13.34 180 top
C16  68.58,15.49 180 top
C17  33.55,7.9 180 top
C18  68.58,11.18 0 top
C19  68.58,9.02 0 top
C20  43.74,5.97 270 top
C21  63.5,15.47 0 top
C22  63.5,13.34 0 top
C23  63.5,11.18 0 top
C25  41.12,15.27 0 top
CR1  10.74,68.96 180 top
D1  25.4,36.2 0 top
D2  42.57,20.83 0 top
J1  74.3,34.29 90 top
J2  6.35,52.07 90 top
J3  1.27,26.67 90 top
J4  6.35,26.67 90 top
J5  1.27,52.07 90 top
J6  49.53,3.81 0 top
J10  23.5,76.2 0 top
J11  20.32,6.35 90 top
JP1  44.77,45.09 270 top
JP2  47.94,45.09 90 top
L1  46.48,27.05 0 top
LED1  76.2,43.81 0 top
LED2  76.2,41.76 0 top
LED3  76.2,11.43 0 top
LED4  76.2,13.34 0 top
LED5  45.72,67.94 180 top
LED6  19.05,13.97 90 top
M01  15.24,45.09 270 top
M02  15.24,20.32 270 top
M11  12.7,45.09 270 top
M12  12.7,20.32 270 top
Q1  31.11,36.2 90 top
Q2  35.56,36.2 90 top
R1  72.39,25.4 90 top
R2  12.7,62.23 90 top
R3  9.19,49.68 270 top
R4  11.43,62.23 90 top
R5  13.97,62.23 90 top
R6  10.46,49.66 270 top
R7  72.39,41.71 0 top
R8  20.32,53.34 0 top
R9  15.24,62.23 90 top
R10  12.57,37.69 90 top
R11  73.03,11.25 180 top
R12  73.03,13.34 0 top
R13  10.79,66.67 180 top
R14  34.62,41.91 90 top
R15  10.16,23.81 0 top
R16  11.3,37.67 90 top
R17  13.94,37.72 90 top
R18  20.42,27.3 0 top
R19  15.14,37.72 90 top
R20  72.39,43.81 0 top
R21  45.72,69.85 180 top
R22  40.01,42.57 0 top
R23  30.25,41.91 90 top
R24  6.35,12.06 180 top
R25  20.95,13.97 270 top
R26  32.44,41.91 90 top
R27  40.01,40.39 0 top
R28  28.09,41.91 90 top
R29  25.91,41.91 90 top
R30  22.23,66.04 180 top
R31  16.51,66.67 180 top
R32  23.7,41.91 90 top
R33  51.64,18.59 270 top
R34  52.25,12.93 180 top
R35  53.95,18.59 270 top
R36  52.3,10.72 0 top
S3  15.88,75.56 0 top
TM1  19.68,36.83 180 top
TM2  20.32,62.23 180 top
U1  59.69,71.12 90 top
U2  59.69,45.72 270 top
U3  60.33,31.75 0 top
U4  13.97,30.48 0 top
U5  13.97,55.88 0 top
U6  34.29,58.42 0 top
U7  32.38,22.23 0 top
U8  63.5,3.81 180 top
U9  40.01,76.2 180 top
U10  12.06,2.54 270 top
U11  46.56,15.29 0 top
U$1  57.78,58.42 270 top
U$2  [LOGO-L]  78.74,60.96 270 bottom
U$3  73.66,20.32 270 top
U$4  [SRM-LOGO-M]  20.32,72.39 270 bottom
X1  77.47,58.42 90 top
Y1  24.13,19.68 270 top

### Tracks (layer width: path | path; a pad name or v marks a point on that pad's centre or on a via)
+3V3  (via drill 0.35)
  Top 0.305: 33.3,34.29 Q1.1 | 33.3,34.29 35.56,34.29 36.48,35.22 Q2.1 38.72,35.55 | 33.3,34.29 29.21,34.29 28.57,34.92 28.57,36.2 27.88,36.9 D1.A 26.9,37.47 v27.96,38.53 | 38.72,35.55 40.85,37.68 R27.2 R22.2 | C15.1 C16.1 C14.1 | 74.12,17.6 C14.1 | 74.12,17.6 74.61,18.09 U$3.5 75.06,19.18 76.2,20.32 76.2,22.23 74.6,23.82 C3.1 | LED4.A 76.95,14.77 74.12,17.6 | v16.83,63.82 15.66,64.98 R31.2 13.76,64.77 10.79,64.77 9.95,65.62 R13.2 | S3.3 18.91,73.03 23.5,73.03 | J10.3 28.57,74.3 27.3,73.03 23.5,73.03 | v20.95,67.94 20.95,70.48 23.5,73.03 | v26.7,48.26 25.99,48.97 U6.VCC 23.97,50.22 23.09,51.1 23.09,60.73 21.59,62.23 20.95,62.23 20.32,62.87 20.32,64.77 19.68,65.41 | C14.1 69.43,23.05 v66.8,25.68 | v41.4,29.18 41.4,32.86 38.72,35.55 | v18.41,65.41 19.68,65.41 | 19.68,65.41 20.32,66.04 R30.2
  Bottom 0.305: v16.83,63.82 v18.41,65.41 v20.95,67.94 | v27.96,38.53 30.25,40.82 30.25,44.96 26.95,48.26 v26.7,48.26 | v66.8,25.68 55.58,25.68 53.37,27.89 42.7,27.89 v41.4,29.18
+5V  (via drill 0.35)
  Top 0.305: 15.09,44.68 M11.2 12.7,43.81 11.43,42.55 4.45,42.55 2.46,44.53 C7.+ | 15.09,44.68 M01.2 21.83,44.68 v22.86,45.71 20.95,47.61 v20.95,51.44 20.95,53.33 R8.2 20.97,54.38 C11.2 | LED3.A 76.95,9.64 75.56,8.26 72.39,8.26 71.12,6.99 68.58,6.99 67.73,7.83 C19.1 C18.1 66.29,11.18 v66.04,11.43 | v6.35,8.89 5.5,9.74 R24.2 5.5,17.36 C6.+ | C13.1 C4.1 | C13.1 C1.1 75.75,28.36 v76.5,27.61 | R1.2 C13.1 | U7.4 25.68,22.62 | 25.68,22.62 27.28,21.02 U7.6 34.22,21.02 35.02,20.23 U7.18 | R26.2 R23.2 29.11,43.9 v29.11,44.6 | 15.14,38.42 15.14,44.63 15.09,44.68 | 15.14,38.42 R19.2 | R9.2 16.22,62.88 v17.45,61.65 | 25.68,22.62 v25.45,22.62 18.52,22.62 16,20.1 15.43,20.1 M02.2 M12.2 11.34,19.91 v9.53,18.1 | v74.62,22.83 74.62,21.48 U$3.1 | U$1.24 64.77,52.65 v65.68,51.74 | v24.77,27.3 R18.2 C9.2 21.07,29.1 v20.95,29.21 | v16.19,39.05 15.77,39.05 15.14,38.42
  Top 0.508: U7.18 38.64,20.23 39.37,20.95 39.37,26.04 v40.01,26.67
  Top 1.016: U3.3 64.92,22.07 v66.04,20.95
  Bottom 0.305: v6.35,8.89 10.16,8.89 15.24,3.81 J11.2 | v66.04,11.43 v66.04,20.95 72.69,27.61 | v17.45,61.65 17.45,54.94 v20.95,51.44 | v25.45,22.62 25.45,26.62 v24.77,27.3 | v29.11,44.6 28,45.71 v22.86,45.71 | v74.62,22.83 76.5,24.71 v76.5,27.61 72.69,27.61 | v65.68,51.74 65.68,34.62 72.69,27.61 | v20.95,29.21 19.05,31.11 19.05,35.24 16.19,38.1 v16.19,39.05 | v9.53,18.1 6.03,18.1 3.81,20.32 C6.+
  Bottom 1.016: v40.01,26.67 52.07,26.67 54.61,24.13 64.77,24.13 66.04,22.86 v66.04,20.95
+24V  (via drill 0.35)
  Top 0.305: U1.10 64.77,73.66 72.51,65.92 X1.16 75.33,65.92 77.55,63.7 77.55,54.05 75.56,52.07 | J1.2 75.56,36.83 78.11,39.37 78.11,42.66 LED1.A 76.95,46.24 75.56,47.62 75.56,52.07 | 75.56,52.07 74.72,52.92 X1.3 | U2.10 54.61,38.66 55.8,37.47 69.29,37.47 v71.07,35.69
  Top 0.508: U2.10 51.44,38.02 20V!.2
  Bottom 0.305: v71.07,35.69 73.15,35.69 J1.2
A0  (via drill 0.35)
  Top 0.305: U$1.10 53.34,60.91 v55.4,58.85 | v40.49,29.95 38.53,27.99 38.53,24.74 38.02,24.23 U7.23
  Bottom 0.305: v55.4,58.85 55.4,44.86 v40.49,29.95
A1  (via drill 0.35)
  Top 0.305: U7.24 36.68,27.25 v40.64,31.22 | v52.09,60.45 52.07,60.48 U$1.11
  Bottom 0.305: v40.64,31.22 52.09,42.67 v52.09,60.45
A2  (via drill 0.35)
  Top 0.305: U$1.14 52.07,52.27 v51.33,51.54 | v39.57,31.5 37.69,31.5 35.23,29.03 35.23,26.56 U7.25
  Bottom 0.305: v51.33,51.54 51.33,43.26 v39.57,31.5
A3  (via drill 0.35)
  Top 0.305: U7.26 34.38,30.02 37.41,33.05 v39.57,33.05 | v49.84,51.46 50.8,52.43 U$1.13
  Bottom 0.305: v39.57,33.05 49.84,43.31 v49.84,51.46
DIR1  (via drill 0.35)
  Top 0.305: U4.12 11.17,26.14 v12.01,25.3 | v21.49,25.86 28.93,25.86 U7.32
  Bottom 0.305: v12.01,25.3 17.32,25.3 18.92,23.7 20.65,23.7 21.46,24.51 21.46,25.83 v21.49,25.86
DIR2  (via drill 0.35)
  Top 0.305: U5.12 11.17,51.85 v11.53,51.49 | v14.05,49.89 15.11,49.89 v16.08,48.92 | v22.3,24.21 28.07,24.21 U7.2
  Bottom 0.305: v11.53,51.49 12.45,51.49 v14.05,49.89 | v16.08,48.92 16.08,41.17 19.89,37.36 19.89,32.13 23.09,28.93 23.09,24.99 v22.3,24.21
DTR  (via drill 0.35)
  Top 0.305: CR1.1 v13.34,68.96 15.61,68.96 C8.1
  Bottom 0.305: J10.6 36.2,74.93 34.29,73.03 22.23,73.03 19.68,70.48 14.86,70.48 v13.34,68.96
ENB  (via drill 0.35)
  Top 0.305: U5.10 10.22,53.6 9.83,53.21 9.83,51.79 10.46,51.16 10.46,50.34 | 10.46,50.34 R6.1 | U4.10 12.97,28.2 v13.03,28.27 | v11.94,50.32 10.49,50.32 10.46,50.34
  Bottom 0.305: v11.94,50.32 9.6,47.98 7.67,47.98 4.93,45.24 4.93,42.86 4.93,42.09 12.06,34.95 12.06,29.21 13.01,28.27 v13.03,28.27
ESPRST  (via drill 0.35)
  Top 0.305: C8.2 R31.1 18.1,66.67 18.41,66.99 21.27,66.99 21.59,67.31 24.77,67.31 25.4,66.67 25.4,64.81 U6.RESET 29.12,64.22 v29.21,64.14 | v40.01,73.03 U9.2
  Bottom 0.305: v29.21,64.14 31.11,64.14 v40.01,73.03
ESPRX  (via drill 0.35)
  Top 0.305: J10.4 31.11,69.22 38.1,62.23 v39.6,62.23 U6.RXD0 | JP1.2 43.23,45.09 v42.72,44.58
  Bottom 0.305: v42.72,44.58 42.72,59.11 v39.6,62.23
ESPTX  (via drill 0.35)
  Top 0.305: U6.TXD0 v42.39,67.47 J10.5 | JP2.2 49.2,45.09 50.19,46.08 50.19,47.75 49.33,48.62 46.53,48.62 v45.8,49.35
  Bottom 0.305: v45.8,49.35 45.8,64.06 v42.39,67.47
GND  (via drill 0.35)  (12 unrouted)
  Top 0.305: C25.1 40.25,15.48 41.27,16.51 v42.55,16.51 43.36,15.69 U11.2 45.9,15.69 46.43,15.16 | R5.2 R2.2 R4.2 8.88,62.88 v7.62,64.14 7.62,69.85 10.16,72.39 v12.2,72.39 S3.1 | C7.- 9.2,46.74 R3.2 | R11.1 73.88,11.63 R12.1 70.02,11.18 C18.2 | C21.2 C22.2 C23.2 C5.2 | C16.2 C15.2 69.43,11.63 C18.2 | C16.2 64.38,15.49 C21.2 | C14.2 C16.2 | C19.2 C18.2 | C21.2 64.35,17.57 63.5,18.41 v61.59,18.41 60.33,19.68 U3.2 U3.4 62.87,34.29 J1.1 | U11.4 45.36,14.09 46.43,15.16 | 46.43,15.16 U11.9 | R34.1 55.02,12.93 v55.88,12.06 | v46.99,12.06 46.43,12.62 46.43,15.16 | U7.5 29.45,21.82 30.25,22.62 | 30.25,22.62 v30.81,22.62 v34.19,22.62 U7.21 | 20.95,14.83 20.95,18.41 22.23,19.68 Y1.2 25.81,19.68 v26.06,19.43 | 20.95,14.83 R25.1 | R17.2 12.6,38.37 R10.2 11.33,38.34 R16.2 9.94,38.32 v8.26,40.01 | C10.1 18.53,32.1 U4.21 15.6,32.1 U4.EPAD 13.99,30.45 13.99,25.22 12.59,23.81 R15.2 10.79,23.8 10.79,20.95 10.16,20.32 C6.- 7.62,17.14 12.06,12.7 U10.1 14.99,8.89 J11.6 19.05,10.34 20.27,11.56 21.79,11.56 22.91,12.68 22.91,14.15 22.23,14.83 20.95,14.83 | U9.1 46.57,73.49 R21.1 50.8,65.62 | 50.8,65.62 U$1.12 50.8,59.82 53.37,57.25 53.37,53.92 U$1.15 53.34,52.7 54.61,51.44 U2.9 42.41,50.24 U6.GND 42.44,50.17 42.44,47.22 42.11,46.89 40.97,46.89 37.13,43.05 v37.13,41.99 36.21,41.06 R14.1 | 15.6,57.51 U5.21 18.53,57.51 C12.1 | 15.6,57.51 U5.EPAD | C1.2 C13.2 C4.2 69.43,30.06 68.58,29.21 68.58,27.3 69.64,26.25 C2.2 | J1.1 74.55,34.04 C1.2 | C3.2 76.42,26.25 77.47,27.3 v77.47,29.21 76.62,30.06 C1.2 | R20.1 R7.1 71.54,37.05 J1.1 | U1.9 64.77,67.94 63.5,69.22 54.4,69.22 50.8,65.62 | 15.6,57.51 14.94,58.16 v14.94,58.5
  Top 0.305: 25.81,33.93 v25.81,33.98 | U7.3 29.45,23.43 30.25,22.62 | U$3.2 v73.66,20.27 | TM2.1 22.04,64.77 v22.23,64.77
  Top 0.406: R6.2 9.22,49.01 R3.2
  Top 1.016: C20.- 44.08,3.81 39.99,7.9 C17.-
  Bottom 0.305: v61.59,18.41 55.88,12.7 v55.88,12.06 v46.99,12.06 46.99,6.35 v46.35,5.71 | v8.26,40.01 8.26,44.37 C7.- 13.82,45.09 15.32,46.58 15.32,58.12 v14.94,58.5 9.3,64.14 v7.62,64.14 | v12.2,72.39 18.41,72.39 22.23,76.2 J10.1 | v25.81,33.98 25.81,35.1 30.23,39.52 34.67,39.52 v37.13,41.99 | v26.06,19.43 27.62,19.43 v30.81,22.62 | v34.19,22.62 36.43,22.62 v42.55,16.51 | v73.66,20.27 75.08,20.27 77.78,22.96 77.78,28.91 v77.47,29.21
  other vias: 13.34,56.52 14.61,56.52 14.61,55.24 13.34,55.24 13.34,31.11 14.61,31.11 13.34,29.84 14.61,29.84 3.17,69.22 4.45,69.22 4.45,67.94 3.17,67.94 68.58,76.2 69.85,76.2 69.85,74.93 68.58,74.93 46.35,4.76 46.35,3.81 46.35,2.86
  pour Top (isolate 0.254): 0,80.01 80.01,80.01 80.01,0 0,0
  pour Bottom (isolate 0.406, hatched): 0,80.01 80.96,80.01 80.96,0 0,0
GPIO0  (via drill 0.35)
  Top 0.305: R13.1 9.63,68.69 CR1.2 11.79,71.12 13.97,71.12 | 13.97,71.12 15.12,72.28 S3.2 | U6.GPIO0 39.66,56.22 26.67,69.22 v24.13,69.22 | v19.68,69.22 19.68,69.85 18.41,71.12 13.97,71.12
  Bottom 0.305: v24.13,69.22 v19.68,69.22
IO12  (via drill 0.35)
  Top 0.305: R29.2 25.91,47.35 v25.15,48.11 | v29.46,54.2 26.01,54.2 U6.GPIO12
  Bottom 0.305: v25.15,48.11 25.15,49.89 v29.46,54.2
IO13
  Top 0.305: R28.2 28.09,51.38 27.15,52.32 26.09,52.32 U6.GPIO13
IO16  (via drill 0.35)
  Top 0.305: R32.2 23.7,48.59 v23.67,48.62 | v28.63,58.24 26.01,58.24 U6.GPIO16
  Bottom 0.305: v23.67,48.62 23.67,53.29 v28.63,58.24
MEGARX  (via drill 0.35)
  Top 0.305: Q2.3 33.66,37.17 v33.66,37.36 33.66,38.73 32.44,39.95 R26.1 | U7.30 31.18,31.11 v33.3,33.22
  Bottom 0.305: v33.3,33.22 33.3,37.01 v33.66,37.36
MEGARXLV  (via drill 0.35)
  Top 0.305: JP2.1 JP1.3 44.77,40.55 v42.72,38.51 | R27.1 v39.16,38.66 39.16,38.52 37.47,36.83 36.5,36.83 Q2.2
  Bottom 0.305: v42.72,38.51 39.31,38.51 v39.16,38.66
MEGATX  (via drill 0.35)
  Top 0.305: Q1.3 30.25,36.26 v30.25,38.25 R23.1 | U7.31 30.39,32.37 v31.32,33.3
  Bottom 0.305: v31.32,33.3 31.32,37.19 v30.25,38.25
MEGATXLV  (via drill 0.35)
  Top 0.305: JP2.3 JP1.1 40.82,45.9 39.16,44.23 39.16,42.65 | 39.16,42.65 R22.1 | Q1.2 32.04,37.96 v32.41,38.33 | v37.62,40.66 37.62,41.11 39.16,42.65
  Bottom 0.305: v32.41,38.33 35.28,38.33 v37.62,40.66
MISO  (via drill 0.35)
  Top 0.305: v35.23,11.4 35.23,17.89 U7.16
  Bottom 0.305: J11.1 27.64,3.81 v35.23,11.4
MOSI
  Top 0.305: U7.15 34.38,14.95 31.93,12.5 28.42,12.5 25.3,9.37 25.3,3.56 23.57,1.83 17.65,1.83 16.54,2.95 16.54,5.41 17.45,6.33 19.02,6.33 J11.4
N$3
  Top 0.305: U$1.2 U1.8
N$4
  Top 0.305: U$1.3 U1.7
N$5
  Top 0.305: U$1.4 U1.6
N$6
  Top 0.305: U$1.5 U1.5
N$7
  Top 0.305: U$1.6 U1.4
N$8
  Top 0.305: U$1.7 U1.3
N$9
  Top 0.305: U$1.8 U1.2
N$10
  Top 0.305: U$1.9 U1.1
N$11
  Top 0.305: U2.1 64.77,51.44 63.5,52.7 U$1.23
N$12
  Top 0.305: U2.2 63.5,51.44 62.23,52.7 U$1.22
N$13
  Top 0.305: U2.3 62.23,51.44 60.96,52.7 U$1.21
N$14
  Top 0.305: U2.4 60.96,51.44 59.69,52.7 U$1.20
N$15
  Top 0.305: U2.5 59.69,51.44 58.42,52.7 U$1.19
N$16
  Top 0.305: U2.6 58.42,51.44 57.15,52.7 U$1.18
N$17
  Top 0.305: U4.7 9.2,30.16 8.26,29.21
  Top 0.508: 8.26,29.21 J4.2 3.81,26.67 J3.1
N$18  (via drill 0.35)
  Top 0.305: U4.9 10.21,28.86 9.7,28.35 9.7,25.73 v10.34,25.09
  Bottom 0.508: v10.34,25.09 7.92,25.09 J4.1 3.81,26.67 J3.2
N$19
  Top 0.305: U4.6 7.29,30.8 J4.3
  Bottom 0.508: J4.3 J3.3
N$20
  Top 0.305: U4.4 9.8,32.1 7.62,34.29 J4.4
  Bottom 0.508: J4.4 J3.4
N$21
  Top 0.305: X1.15 72.24,64.92 63.5,73.66 U1.11
N$22
  Top 0.305: X1.14 71.97,63.92 62.23,73.66 U1.12
N$23
  Top 0.305: X1.13 71.7,62.92 60.96,73.66 U1.13
N$24  (via drill 0.35)
  Top 0.305: X1.6 75.33,55.92 v76,56.59 | v59.77,72.97 59.77,75.56 U1.14
  Bottom 0.305: v76,56.59 76,56.74 v59.77,72.97
N$25  (via drill 0.35)
  Top 0.305: U1.15 58.42,72.62 v59.77,71.27 | v76,55.12 75.8,54.92 X1.5
  Bottom 0.305: v59.77,71.27 59.99,71.27 76.15,55.12 v76,55.12
N$26  (via drill 0.35)
  Top 0.305: X1.4 73.49,53.92 v72.49,54.91 | v57.58,71.91 57.15,72.34 U1.16
  Bottom 0.305: v72.49,54.91 72.49,57 v57.58,71.91
N$27  (via drill 0.35)
  Top 0.305: U1.17 55.88,71.78 v56.31,71.35 | v70.79,56.95 74.19,56.95 X1.7
  Bottom 0.305: v56.31,71.35 56.39,71.35 v70.79,56.95
N$28  (via drill 0.35)
  Top 0.305: X1.8 70.8,57.92 v69.67,56.79 | v54.69,71.5 54.69,75.56 U1.18
  Bottom 0.305: v69.67,56.79 69.39,56.79 v54.69,71.5
N$29
  Top 0.305: U2.8 55.88,51.44 54.61,52.7 U$1.16
N$30
  Top 0.305: U2.18 64.77,46.35 66.67,48.26 66.67,59.05 69.54,61.92 X1.12
N$31
  Top 0.305: U2.17 63.5,40.01 64.14,39.37 66.67,39.37 67.31,40.01 67.31,58.42 69.85,60.96 74.18,60.96 X1.11
N$32
  Top 0.305: U2.16 62.23,40.01 63.5,38.73 67.31,38.73 67.94,39.37 67.94,57.78 70.08,59.92 X1.10
N$33
  Top 0.305: U2.15 60.96,40.01 62.87,38.1 67.94,38.1 68.58,38.73 68.58,57.15 70.35,58.92 X1.9
N$34
  Top 0.305: U2.7 57.15,51.44 55.88,52.7 U$1.17
N$35
  Top 0.305: J2.1 7.57,52.07 8.26,52.76 8.26,54.43 9.4,55.58 11.15,55.58 U5.7
  Top 0.508: J2.1 3.81,52.07 J5.2
N$36  (via drill 0.35)
  Top 0.305: U5.9 12.06,54.26 v12.85,53.47
  Bottom 0.305: v12.85,53.47 7.49,53.47 J2.2
  Bottom 0.508: J2.2 3.81,54.61 J5.1
N$37
  Top 0.305: U11.7 49.35,15.69 49.53,15.88 49.53,17.14 50.16,17.78 51.6,17.78 R33.2 52.25,17.74 R35.1
  Top 0.508: L1.P$1 46.88,28.57 51.44,28.57 52.7,27.3 52.7,21.59 53.98,20.32 53.98,19.47 R35.1
N$38
  Top 0.305: U$3.4 72.26,19.18 70.23,21.21 C2.1
N$39
  Top 0.305: U$3.3 72.71,23.18 72.39,23.5 R1.1
N$40
  Top 0.305: J2.3 6.33,57.15 7.27,56.2 U5.6
  Top 0.508: J2.3 J5.3
N$41
  Top 0.305: U5.4 10.08,57.51 7.85,59.74 6.4,59.74 J2.4
  Top 0.508: J5.4 J2.4
N$42
  Top 0.305: U5.17 19.15,54.91 C11.1
N$43
  Top 0.305: U5.2 10.21,58.8 9.65,59.36 9.65,59.64 10.11,60.1 13.64,60.1 14.05,60.5 14.05,61.5 R5.1
N$44
  Top 0.305: U5.3 10.15,58.16 8.94,59.36 8.94,59.99 9.58,60.63 12.37,60.63 12.72,60.98 12.72,61.55 R2.1
N$45
  Top 0.305: R7.2 75.4,41.71 LED2.C
N$46
  Top 0.305: U5.8 10.05,54.91 9.2,54.05 R3.1
N$47  (via drill 0.35)
  Top 0.305: U5.5 9.31,56.85 v8.43,57.73 | v9.35,61.52 11.37,61.52 R4.1
  Bottom 0.305: v8.43,57.73 8.43,60.6 v9.35,61.52
N$48
  Top 0.305: U5.1 14.47,59.45 15.27,60.25 15.27,61.55 R9.1
N$49
  Top 0.305: U5.16 17.8,54.26 18.77,53.29 19.62,53.29 R8.1
N$50
  Top 0.305: R11.2 72.17,9.79 72.69,9.27 74.98,9.27 75.49,9.78 75.49,11.39 LED3.C
N$51
  Top 0.305: R12.2 LED4.C
N$52
  Top 0.305: R30.1 23.07,62.02 24.87,60.22 U6.CH_PD
N$54
  Top 0.305: U4.2 10.36,33.41 9.6,34.16 9.6,34.57 9.98,34.95 13.18,34.95 13.95,35.71 R17.1
N$55
  Top 0.305: R25.2 19.15,13.12 LED6.C
N$56
  Top 0.305: LED5.C 46.47,68.25 R21.2
N$57  (via drill 0.35)
  Top 0.305: LED6.A 19.05,15.67 v19.43,16.05 | v31.19,16.61 U7.11
  Bottom 0.305: v19.43,16.05 30.63,16.05 v31.19,16.61
N$58
  Top 0.305: Y1.3 27.15,18.48 U7.8
N$59
  Top 0.305: U7.7 26.51,20.23 25.86,20.88 Y1.1
N$60
  Top 0.305: D1.R 25.77,35.49 25.25,36.02 25.25,37.24 28.07,40.06 28.07,41.03 R28.1
N$61
  Top 0.305: D1.B 25.91,38.9 R29.1
N$62
  Top 0.305: D1.G 23.84,35.56 22.86,35.56 22.23,36.2 22.23,38.1 23.7,39.57 R32.1
N$63  (via drill 3.81 pad 5.08)
  other vias: 5.08,5.08
N$64  (via drill 3.81 pad 5.08)
  other vias: 74.93,5.08
N$65
  Top 0.305: U4.3 10.12,32.76 8.69,34.19 8.69,34.92 9.4,35.64 11.84,35.64 12.57,36.37 R10.1
N$66
  Top 0.305: U4.8 9.82,29.5 8.89,28.57 8.89,25.4 9.53,24.77 9.53,23.83 R15.1
N$67  (via drill 0.35)
  Top 0.305: U4.5 9.19,31.45 v7.62,33.02 | v8.89,36.83 9.08,37.02 R16.1
  Bottom 0.305: v7.62,33.02 7.62,35.56 v8.89,36.83
N$68
  Top 0.305: U4.17 18.54,29.5 C9.1
N$69  (via drill 3.81 pad 5.08)
  other vias: 74.93,74.93
N$70  (via drill 3.81 pad 5.08)
  other vias: 5.08,74.93
N$71
  Top 0.508: 38.73,13.34 38.73,16.51 40.64,18.41 40.64,20.8 D2.C 40.67,22.25 42.55,24.13 42.55,31.11 43.18,31.75 50.57,31.75 20V!.1 | C17.+ 33.3,7.9 38.73,13.34 | R36.1 41.35,10.72 38.73,13.34
N$72
  Top 0.305: U11.5 50.24,14.09 R34.2 51.4,12.47 R36.2
N$73
  Top 0.305: U4.1 14.12,34.05 15.19,35.13 15.19,37.02 R19.1
N$74
  Top 0.305: U4.16 18.14,28.86 18.41,28.57 18.41,27.94 19.05,27.3 R18.1
N$75
  Top 0.305: U5.13 16.77,47.02 M01.1
N$76
  Top 0.305: M11.1 12.7,50.7 14.96,52.96 U5.14
N$77  (via drill 0.35)
  Top 0.305: M02.1 15.24,21.97 v15.32,22.05 | v15.39,23.65 16.77,25.02 U4.13
  Bottom 0.305: v15.32,22.05 15.32,23.57 v15.39,23.65
N$78
  Top 0.305: U4.14 17.53,27.55 18.41,26.67 18.41,24.13 17.14,22.86 13.34,22.86 12.7,22.23 M12.1
N$79
  Top 0.305: LED1.C R20.2
N$80
  Top 0.305: LED5.A 45.09,67.83 45.09,59.69 43.62,58.22 U6.GPIO4
N$84  (via drill 0.35)
  Top 0.305: U6.GPIO15 37.84,52.22 v37.21,51.59 | v34.59,44.58 34.59,42.78 R14.2
  Bottom 0.305: v37.21,51.59 37.21,47.19 v34.59,44.58
N$85
  Top 0.305: U11.8 48.49,18.01 49.53,19.05 51.24,19.05 R33.1
N$86
  Top 0.508: 44.63,20.67 D2.A | U11.1 44.63,20.67 | L1.P$2 46.48,22.52 44.63,20.67
N$88
  Top 0.305: U11.3 43.53,14.89 43.19,15.23 42.03,15.23 C25.2
PULSE  (via drill 0.35)
  Top 0.305: LED2.A 76.95,40.53 v76.53,40.11 | U$1.1 v64.77,59.84 | v69.04,33.45 67.28,31.7 v67.28,30.66 | v46.33,33.6 44.22,35.71 v40.72,35.71 | v35.36,32.61 32.84,30.1 v32.84,28.6 | v33.25,20.32 31.17,20.32 30.38,19.53 U7.10
  Bottom 0.305: v64.77,59.84 76.53,48.08 v76.53,40.11 75.44,39.01 70.94,39.01 69.04,37.11 v69.04,33.45 | v67.28,30.66 64.34,33.6 v46.33,33.6 | v40.72,35.71 37.62,32.61 v35.36,32.61 | v32.84,28.6 33.25,28.19 v33.25,20.32
REF1
  Top 0.305: U4.22 U4.23 18.16,33.41 18.41,33.66 18.41,34.29 19.45,35.33 TM1.2
REF2
  Top 0.305: U5.22 U5.23 18.16,58.8 19.05,59.69 19.05,60.33 19.45,60.73 TM2.2
RST  (via drill 0.35)
  Top 0.305: R24.1 7.2,9.95 8.89,8.26 8.89,3.17 9.53,2.54 U10.2 12.06,4.24 v15.06,7.24 | U7.29 31.98,23.67 v32,23.65
  Bottom 0.305: v32,23.65 32,13.26 27.64,8.89 21.64,8.89 | 21.64,8.89 J11.5 | v15.06,7.24 15.06,9.35 16.71,11 20.85,11 21.57,10.29 21.57,8.97 21.64,8.89
SCK  (via drill 0.35)
  Top 0.305: v37.69,16.71 36.68,17.73 U7.17
  Bottom 0.305: J11.3 27.33,6.35 v37.69,16.71
STEP1  (via drill 0.35)
  Top 0.305: v19.43,24.97 28.04,24.97 U7.1 | U4.11 12.25,27.55 v12.83,26.98
  Bottom 0.305: v12.83,26.98 17.42,26.98 v19.43,24.97
STEP2  (via drill 0.35)
  Top 0.305: U5.11 12.2,52.95 12.83,52.32 12.9,52.32 v12.95,52.27 | v14.55,51.13 15.57,51.13 v16.08,50.62 | v24.38,16.82 25.5,17.93 U7.9
  Bottom 0.305: v12.95,52.27 13.41,52.27 v14.55,51.13 | v16.08,50.62 19.38,50.62 20.47,49.53 20.47,34.31 24.03,30.76 24.03,17.17 v24.38,16.82
V_BATT
  Top 1.016: U8.2 66.04,3.76 66.04,2.54 65.1,1.6 61.9,1.6 59.69,3.81 J6.4
VCC  (via drill 0.35)  (1 unrouted)
  Top 0.305: U4.19 17.78,30.8 | 17.78,30.8 18.09,30.8 18.41,30.48 18.09,30.16 17.9,30.16 | 17.9,30.16 U4.18 | 17.78,30.8 17.78,30.28 17.9,30.16 | U5.19 17.78,56.2 | 17.78,56.2 18.09,56.2 18.41,55.88 18.09,55.55 17.89,55.55 | 17.89,55.55 U5.18 | 17.78,56.2 17.78,55.66 17.89,55.55 | U11.6 52.36,14.89 53.95,16.48 R35.2 56.16,17.74 57.47,19.05 57.78,19.05
  Top 1.016: C5.1 62.42,8.79 | C5.1 62.65,7.2 63.5,6.35 66.67,6.35 68.58,4.45 68.58,3.91 U8.1 | C5.1 C23.1 C22.1 C21.1 | 56.52,8.89 57.78,10.16 57.78,19.05 U3.1 54.45,22.07 v53.98,22.54 | 56.52,8.89 44.16,8.89 C20.+ | 56.52,8.89 62.52,8.89 | 18.41,55.88 v21.91,55.88 | v26.04,30.8 25.72,30.48 18.41,30.48
  Bottom 1.016: v53.98,22.54 51.75,24.77 39.37,24.77 37.78,26.35 37.78,27.94 34.92,30.8 v26.04,30.8 21.59,35.24 21.59,49.21 22.54,50.16 22.54,55.24 v21.91,55.88
VINT1
  Top 0.305: C10.2 19.63,31.45 U4.20 16.75,31.47 15.9,31.47 15.57,31.14 15.57,28.55 15.91,28.2 U4.15
VINT2
  Top 0.305: C12.2 21.16,58.38 21.16,57.35 20.66,56.85 U5.20 16.76,56.84 15.98,56.84 15.54,56.41 15.54,54.03 15.97,53.6 U5.15
VREF1
  Top 0.305: U4.24 16.77,37.73 17.7,38.66 TM1.3
VREF2
  Top 0.305: TM2.3 19.32,62.5 16.77,59.95 U5.24

### Text on the board
tPlace: MTX | ETX | ERX | MRX
bPlace: Sprinter - Controller V5.0 | #karpeDiem